# EAGLE design labwiz-board (EAGLE 6.5.0)

## Sheet 1 of 2
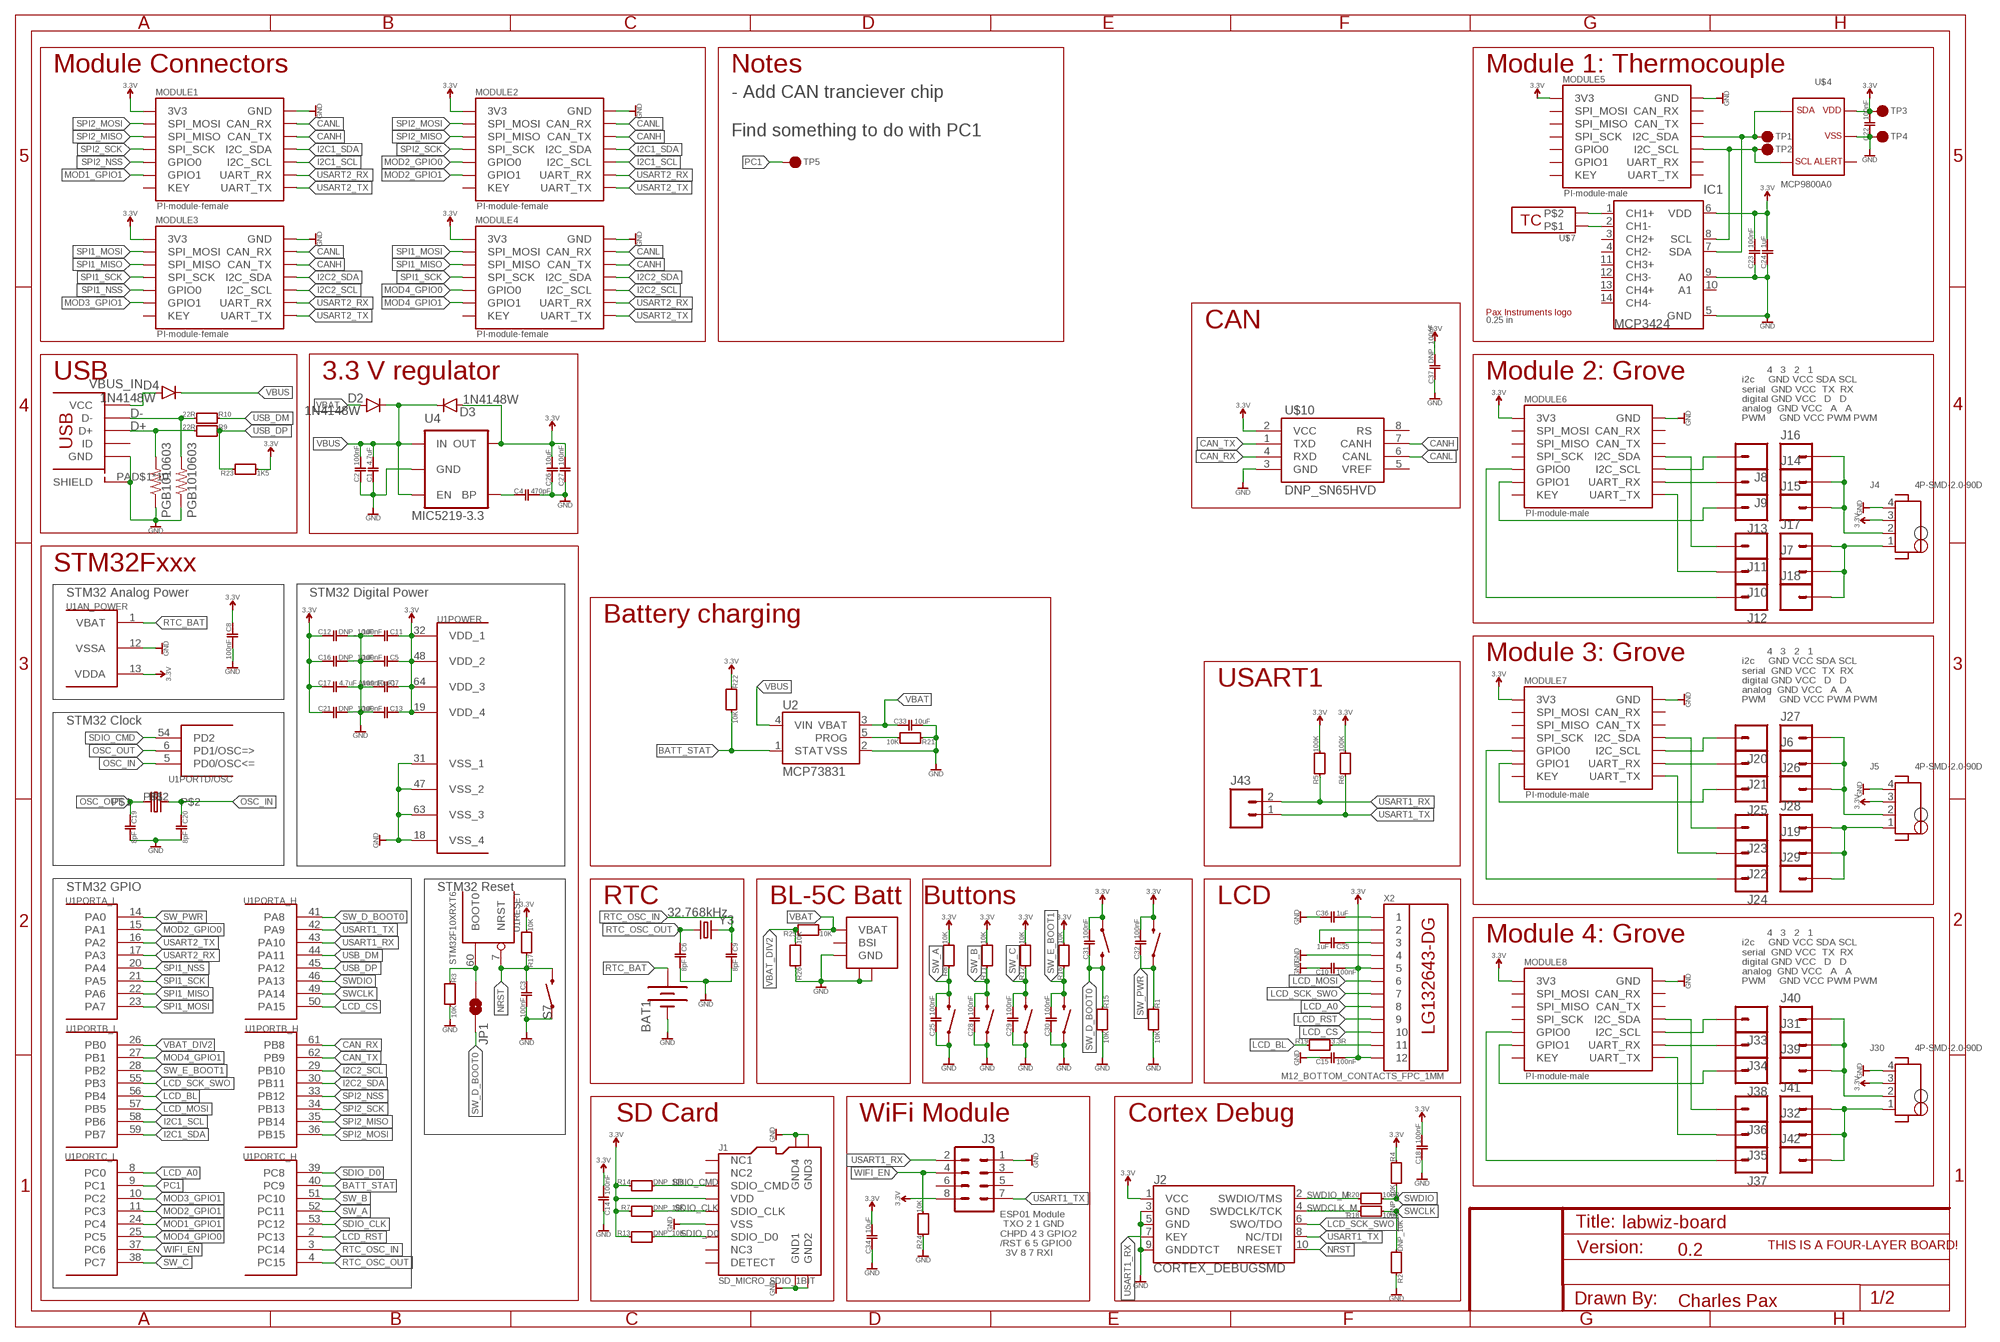
[diagram p0: schematic, sheet 1]

### Parts
BAT1  BATTERY12MM  [BATTCON_12MM]
C1  4.7uF  C0402_4.7UF  [0402]
C2  100nF  C0402_100NF  [0402]
C3  100nF  C0402_100NF  [0402]
C4  470pF  C0402_470PF  [0402]
C5  100nF  C0402_100NF  [0402]
C6  8pF  C0402_8PF  [0402]
C7  100nF  C0402_100NF  [0402]
C8  100nF  C0402_100NF  [0402]
C9  8pF  C0402_8PF  [0402]
C10  100nF  C0402_100NF  [0402]
C11  100nF  C0402_100NF  [0402]
C12  DNP_10uF  C0402_10UF  [0402]
C13  100nF  C0402_100NF  [0402]
C14  100nF  C0402_100NF  [0402]
C15  100nF  C0402_100NF  [0402]
C16  DNP_10uF  C0402_10UF  [0402]
C17  4.7uF (was 10uF)  C0402_10UF  [0402]
C18  100nF  C0402_100NF  [0402]
C19  8pF  C0402_8PF  [0402]
C20  8pF  C0402_8PF  [0402]
C21  DNP_10uF  C0402_10UF  [0402]
C22  100nF  C0402_100NF  [0402]
C23  100nF  C0402_100NF  [0402]
C24  1uF  C0402_1UF  [0402]
C25  100nF  C0402_100NF  [0402]
C26  10uF  C0402_10UF  [0402]
C27  100nF  C0402_100NF  [0402]
C28  100nF  C0402_100NF  [0402]
C29  100nF  C0402_100NF  [0402]
C30  100nF  C0402_100NF  [0402]
C31  100nF  C0402_100NF  [0402]
C32  100nF  C0402_100NF  [0402]
C33  10uF  C0402_10UF  [0402]
C34  10uF  C0402_10UF  [0402]
C35  1uF  C0402_1UF  [0402]
C36  1uF  C0402_1UF  [0402]
C37  DNP_100nF  C0402_100NF  [0402]
D2  1N4148W  DIODESOD123  [SOD-123]
D3  1N4148W  DIODESOD123  [SOD-123]
D4  1N4148W  DIODESOD123  [SOD-123]
IC1  MCP3424  [SO14]
J1  SD_MICRO_SDIO_1BIT  [SD_MICRO_1]
J2  CORTEX_DEBUGSMD  [SAMTECH_FTSH-105-01]
J3  M04X2  [2X4]
J4  4P-SMD-2.0-90D  GROVE-CONNECTOR-SMD-90D(4+2P-2.0)  [HW4-SMD-2.0-90D]
J5  4P-SMD-2.0-90D  GROVE-CONNECTOR-SMD-90D(4+2P-2.0)  [HW4-SMD-2.0-90D]
J6  M01SMD-4.5X1.5  [PAD-1.5X4.5]
J7  M01SMD-4.5X1.5  [PAD-1.5X4.5]
J8  M01SMD-4.5X1.5  [PAD-1.5X4.5]
J9  M01SMD-4.5X1.5  [PAD-1.5X4.5]
J10  M01SMD-4.5X1.5  [PAD-1.5X4.5]
J11  M01SMD-4.5X1.5  [PAD-1.5X4.5]
J12  M01SMD-4.5X1.5  [PAD-1.5X4.5]
J13  M01SMD-4.5X1.5  [PAD-1.5X4.5]
J14  M01SMD-4.5X1.5  [PAD-1.5X4.5]
J15  M01SMD-4.5X1.5  [PAD-1.5X4.5]
J16  M01SMD-4.5X1.5  [PAD-1.5X4.5]
J17  M01SMD-4.5X1.5  [PAD-1.5X4.5]
J18  M01SMD-4.5X1.5  [PAD-1.5X4.5]
J19  M01SMD-4.5X1.5  [PAD-1.5X4.5]
J20  M01SMD-4.5X1.5  [PAD-1.5X4.5]
J21  M01SMD-4.5X1.5  [PAD-1.5X4.5]
J22  M01SMD-4.5X1.5  [PAD-1.5X4.5]
J23  M01SMD-4.5X1.5  [PAD-1.5X4.5]
J24  M01SMD-4.5X1.5  [PAD-1.5X4.5]
J25  M01SMD-4.5X1.5  [PAD-1.5X4.5]
J26  M01SMD-4.5X1.5  [PAD-1.5X4.5]
J27  M01SMD-4.5X1.5  [PAD-1.5X4.5]
J28  M01SMD-4.5X1.5  [PAD-1.5X4.5]
J29  M01SMD-4.5X1.5  [PAD-1.5X4.5]
J30  4P-SMD-2.0-90D  GROVE-CONNECTOR-SMD-90D(4+2P-2.0)  [HW4-SMD-2.0-90D]
J31  M01SMD-4.5X1.5  [PAD-1.5X4.5]
J32  M01SMD-4.5X1.5  [PAD-1.5X4.5]
J33  M01SMD-4.5X1.5  [PAD-1.5X4.5]
J34  M01SMD-4.5X1.5  [PAD-1.5X4.5]
J35  M01SMD-4.5X1.5  [PAD-1.5X4.5]
J36  M01SMD-4.5X1.5  [PAD-1.5X4.5]
J37  M01SMD-4.5X1.5  [PAD-1.5X4.5]
J38  M01SMD-4.5X1.5  [PAD-1.5X4.5]
J39  M01SMD-4.5X1.5  [PAD-1.5X4.5]
J40  M01SMD-4.5X1.5  [PAD-1.5X4.5]
J41  M01SMD-4.5X1.5  [PAD-1.5X4.5]
J42  M01SMD-4.5X1.5  [PAD-1.5X4.5]
J43  M02PTH  [1X02]
JP1  JUMPER-PAD-2-NOYES_SILK  [PAD-JUMPER-2-NO_YES_SILK]
MODULE1  PI-module-female  PAX_MODULE_EDGE_FEMALE_HOST  [M07X2_2MM_EDGE]
MODULE2  PI-module-female  PAX_MODULE_EDGE_FEMALE_HOST  [M07X2_2MM_EDGE]
MODULE3  PI-module-female  PAX_MODULE_EDGE_FEMALE_HOST  [M07X2_2MM_EDGE]
MODULE4  PI-module-female  PAX_MODULE_EDGE_FEMALE_HOST  [M07X2_2MM_EDGE]
MODULE5  PI-module-male  PAX_MODULE_EDGE_MALE_MODULE  [M07X2_2MM_EDGE]
MODULE6  PI-module-male  PAX_MODULE_EDGE_MALE_MODULE  [M07X2_2MM_EDGE]
MODULE7  PI-module-male  PAX_MODULE_EDGE_MALE_MODULE  [M07X2_2MM_EDGE]
MODULE8  PI-module-male  PAX_MODULE_EDGE_MALE_MODULE  [M07X2_2MM_EDGE]
R1  10K  R0402_10K  [0402]
R2  DNP_10K  R0402_10K  [0402]
R3  10K  R0402_10K  [0402]
R4  DNP_10K  R0402_10K  [0402]
R5  100K  R0402_10K  [0402]
R6  100K  R0402_10K  [0402]
R7  DNP_10K  R0402_10K  [0402]
R8  10K  R0402_10K  [0402]
R9  22R  R0402_22R  [R0402]
R10  22R  R0402_22R  [R0402]
R11  10K  R0402_10K  [0402]
R12  10K  R0402_10K  [0402]
R13  DNP_10K  R0402_10K  [0402]
R14  DNP_10K  R0402_10K  [0402]
R15  10K  R0402_10K  [0402]
R16  10K  R0402_10K  [0402]
R17  10K  R0402_10K  [0402]
R18  100R  R0402_100R  [0402]
R19  3.3R  R0402_3.3R  [0402]
R20  100R  R0402_100R  [0402]
R21  10K  R0402_10K  [0402]
R22  10K  R0402_10K  [0402]
R23  1K5  R0402_22R  [R0402]
R24  10K  R0402_10K  [0402]
R25  10K  R0402_10K  [0402]
R26  10K  R0402_10K  [0402]
S1  SWITCH-MOMENTARY-2SMD  [TACTILE_SWITCH_SMD]
S2  SWITCH-MOMENTARY-2SMD  [TACTILE_SWITCH_SMD]
S3  SWITCH-MOMENTARY-2SMD  [TACTILE_SWITCH_SMD]
S4  SWITCH-MOMENTARY-2SMD  [TACTILE_SWITCH_SMD]
S5  SWITCH-MOMENTARY-2SMD  [TACTILE_SWITCH_SMD]
S6  SWITCH-MOMENTARY-2SMD  [TACTILE_SWITCH_SMD]
S7  SWITCH-MOMENTARY-2SMD-3  [TACTILE_SWITCH_SMD-3]
TP1  M01_TH  [M01_TH]
TP2  M01_TH  [M01_TH]
TP3  M01_TH  [M01_TH]
TP4  M01_TH  [M01_TH]
TP5  M01_PAD_1MM  [PAD_1MM]
U1  STM32F10XRXT6  [TQFP64]
U2  MCP73831  [SOT23-5]
U4  MIC5219-3.3V  V_REG_LDOSMD  [SOT23-5]
U$1  USB_MICROSMT+THRUHULE  [USB_MICRO_THRUHOLE]
U$2  FOUR_LAYER_WARNING  [FOUR_LAYER_WARNING]
U$3  BL-5C-CONNECTOR  [BL-5C-CONNECTOR]
U$4  MCP9800A0  [SOT23-5L]
U$5  LG132643-DG  [LG132643-DG]
U$7  THERMOCOUPLE_MINI_INSIDE  [THERMOCOUPLE_CLIP_INSIDE]
U$9  NX3225GD  [NX3225GD]
U$10  DNP_SN65HVD  SN65HVD  [SO08]
U$13  0.25 in  PAX-LOGO_0.25IN  [PAX-LOGO-0.25IN]
X2  M12_BOTTOM_CONTACTS_FPC_1MM  [FPC_12P_1MM]
Y3  32.768kHz  CRYSTAL3.2X1.5MM  [CRYSTAL-SMD-3.2X1.5MM]
Z1  PGB1010603  SPARKFUN-RESISTORS_RESISTOR0603-RES  [SPARKFUN-RESISTORS_0603-RES]
Z2  PGB1010603  SPARKFUN-RESISTORS_RESISTOR0603-RES  [SPARKFUN-RESISTORS_0603-RES]

### Nets
3.3V: C5.1 C7.1 C8.1 C10.2 C11.1 C12.1 C13.1 C14.2 C15.2 C16.1 C17.1 C18.2 C21.1 C26.2 C27.2 C31.2 C32.2 C34.2 C37.2 D3.A J1.4(VDD) J2.1(VCC) J3.8 MODULE1.P$1(3V3) MODULE2.P$1(3V3) MODULE3.P$1(3V3) MODULE4.P$1(3V3) R4.2 R5.1 R6.1 R7.2 R8.1 R11.1 R12.1 R13.2 R14.2 R16.1 R17.1 R22.2 R23.1 S4.1 S6.3 U1.13(AN_POWER:VDDA) U1.19(POWER:VDD_4) U1.32(POWER:VDD_1) U1.48(POWER:VDD_2) U1.64(POWER:VDD_3) U4.5(OUT) U$10.2(VCC) X2.5 X2.12
3.3V_1: C22.2 C23.2 C24.2 IC1.6(VDD) MODULE5.P$13(3V3) TP3.P$1 U$4.1 ; supply symbol labelled 3.3V
3.3V_2: J4.3 MODULE6.P$13(3V3) ; supply symbol labelled 3.3V
3.3V_3: J5.3 MODULE7.P$13(3V3) ; supply symbol labelled 3.3V
3.3V_4: J30.3 MODULE8.P$13(3V3) ; supply symbol labelled 3.3V
BATT_STAT: R22.1 U1.40(PORTC_H:PC9) U2.1(STAT)
BOOT0: JP1.2 R3.2 U1.60(RESET:BOOT0)
CAN_RX: U1.61(PORTB_H:PB8) U$10.4(RXD)
CAN_TX: U1.62(PORTB_H:PB9) U$10.1(TXD)
CANH: MODULE1.P$6(CAN_TX) MODULE2.P$6(CAN_TX) MODULE3.P$6(CAN_TX) MODULE4.P$6(CAN_TX) U$10.7(CANH)
CANL: MODULE1.P$4(CAN_RX) MODULE2.P$4(CAN_RX) MODULE3.P$4(CAN_RX) MODULE4.P$4(CAN_RX) U$10.6(CANL)
D+: R9.1 U$1.PIN$3(D+) Z1.2
D-: R10.1 U$1.PIN$2(D-) Z2.2
GND [GND]: BAT1.GND(-) C1.1 C2.1 C3.2 C4.2 C5.2 C6.2 C7.2 C8.2 C9.2 C10.1 C11.2 C12.2 C13.2 C14.1 C15.1 C16.2 C17.2 C18.1 C19.2 C20.2 C21.2 C25.1 C26.1 C27.1 C28.1 C29.1 C30.1 C33.2 C34.1 C36.1 C37.1 J1.6(VSS) J1.G1(GND1) J1.G2(GND2) J1.G3(GND3) J1.G4(GND4) J2.3(GND) J2.5(GND) J2.9(GNDDTCT) J3.1 MODULE1.P$2(GND) MODULE2.P$2(GND) MODULE3.P$2(GND) MODULE4.P$2(GND) R1.1 R2.2 R3.1 R15.1 R21.2 R24.2 R26.2 S1.1 S2.1 S3.1 S5.1 S7.1 U1.12(AN_POWER:VSSA) U1.18(POWER:VSS_4) U1.31(POWER:VSS_1) U1.47(POWER:VSS_2) U1.63(POWER:VSS_3) U2.2(VSS) U4.2(GND) U$1.PAD$1(SHIELD) U$1.PAD$2(SHIELD) U$1.PAD$3(SHIELD) U$1.PAD$4(SHIELD) U$1.PAD$5(SHIELD) U$1.PAD$6(SHIELD) U$1.PAD$7(SHIELD) U$1.PAD$8(SHIELD) U$1.PAD$9(SHIELD) U$1.PAD$10(SHIELD) U$1.PIN$5(GND) U$3.P$3(GND) U$3.P$4 U$3.P$5 U$10.3(GND) X2.4 Z1.1 Z2.1
GND_1 [GND]: C22.1 C23.1 C24.1 IC1.5(GND) IC1.9(A0) MODULE5.P$14(GND) TP4.P$1 U$4.2 ; supply symbol labelled GND
GND_2 [GND]: J4.4 MODULE6.P$14(GND) ; supply symbol labelled GND
GND_3 [GND]: J5.4 MODULE7.P$14(GND) ; supply symbol labelled GND
GND_4 [GND]: J30.4 MODULE8.P$14(GND) ; supply symbol labelled GND
I2C1_SCL: MODULE1.P$10(I2C_SCL) MODULE2.P$10(I2C_SCL) U1.58(PORTB_L:PB6)
I2C1_SDA: MODULE1.P$8(I2C_SDA) MODULE2.P$8(I2C_SDA) U1.59(PORTB_L:PB7)
I2C2_SCL: MODULE3.P$10(I2C_SCL) MODULE4.P$10(I2C_SCL) U1.29(PORTB_H:PB10)
I2C2_SDA [3.3V power]: MODULE3.P$8(I2C_SDA) MODULE4.P$8(I2C_SDA) U1.30(PORTB_H:PB11)
LCD_A0: U1.8(PORTC_L:PC0) X2.8
LCD_BL: R19.2 U1.56(PORTB_L:PB4)
LCD_CS: U1.50(PORTA_H:PA15) X2.10
LCD_MOSI: U1.57(PORTB_L:PB5) X2.6
LCD_RST: U1.2(PORTC_H:PC13) X2.9
LCD_SCK_SWO: J2.6(SWO/TDO) U1.55(PORTB_L:PB3) X2.7
MOD1_GPIO1: MODULE1.P$11(GPIO1) U1.24(PORTC_L:PC4)
MOD2_GPIO0: MODULE2.P$9(GPIO0) U1.15(PORTA_L:PA1)
MOD2_GPIO1: MODULE2.P$11(GPIO1) U1.11(PORTC_L:PC3)
MOD3_GPIO1: MODULE3.P$11(GPIO1) U1.10(PORTC_L:PC2)
MOD4_GPIO0: MODULE4.P$9(GPIO0) U1.25(PORTC_L:PC5)
MOD4_GPIO1: MODULE4.P$11(GPIO1) U1.27(PORTB_L:PB1)
N$1: C4.1 U4.4(BP)
N$4: R19.1 X2.11
N$5: J4.2 J14.P$1 J15.P$1 J16.P$1
N$13: J5.2 J6.P$1 J26.P$1 J27.P$1
N$25: IC1.2(CH1-) U$7.P$1
N$26: IC1.1(CH1+) U$7.P$2
N$37: C35.1 X2.3
N$38: C35.2 X2.2
N$39: C36.2 X2.1
N$42: J4.1 J7.P$1 J17.P$1 J18.P$1
N$43: J5.1 J19.P$1 J28.P$1 J29.P$1
N$45: J20.P$1 MODULE7.P$6(I2C_SCL)
N$47: J21.P$1 MODULE7.P$4(UART_RX)
N$51: J8.P$1 MODULE6.P$6(I2C_SCL)
N$52: J9.P$1 MODULE6.P$4(UART_RX)
N$53: J10.P$1 MODULE6.P$2(UART_TX)
N$54: J11.P$1 MODULE6.P$8(I2C_SDA)
N$55: J13.P$1 MODULE6.P$3(GPIO1)
N$56: J12.P$1 MODULE6.P$5(GPIO0)
N$57: J22.P$1 MODULE7.P$2(UART_TX)
N$58: J23.P$1 MODULE7.P$8(I2C_SDA)
N$59: J25.P$1 MODULE7.P$3(GPIO1)
N$60: J24.P$1 MODULE7.P$5(GPIO0)
N$61: J30.2 J31.P$1 J39.P$1 J40.P$1
N$62: J30.1 J32.P$1 J41.P$1 J42.P$1
N$63: J33.P$1 MODULE8.P$6(I2C_SCL)
N$64: J34.P$1 MODULE8.P$4(UART_RX)
N$65: J35.P$1 MODULE8.P$2(UART_TX)
N$66: J36.P$1 MODULE8.P$8(I2C_SDA)
N$67: J38.P$1 MODULE8.P$3(GPIO1)
N$68: J37.P$1 MODULE8.P$5(GPIO0)
N$70: R21.1 U2.5(PROG)
NRST: C3.1 J2.10(NRESET) R17.2 S7.4 U1.7(RESET:NRST)
OSC_IN: C20.1 U1.5(PORTD/OSC:PD0/OSC<=) U$9.P$2
OSC_OUT: C19.1 U1.6(PORTD/OSC:PD1/OSC=>) U$9.P$1
PC1: TP5.P$1 U1.9(PORTC_L:PC1)
RTC_BAT [RTC battery]: BAT1.PWR@1(+) U1.1(AN_POWER:VBAT)
RTC_OSC_IN: C9.1 U1.3(PORTC_H:PC14) Y3.P$2
RTC_OSC_OUT: C6.1 U1.4(PORTC_H:PC15) Y3.P$1
SCL_1: IC1.8(SCL) MODULE5.P$6(I2C_SCL) TP2.P$1 U$4.4
SDA_1: IC1.7(SDA) MODULE5.P$8(I2C_SDA) TP1.P$1 U$4.5
SDIO_CLK: J1.5(SDIO_CLK) R7.1 U1.53(PORTC_H:PC12)
SDIO_CMD: J1.3(SDIO_CMD) R14.1 U1.54(PORTD/OSC:PD2)
SDIO_D0: J1.7(SDIO_D0) R13.1 U1.39(PORTC_H:PC8)
SPI1_MISO: MODULE3.P$5(SPI_MISO) MODULE4.P$5(SPI_MISO) U1.22(PORTA_L:PA6)
SPI1_MOSI: MODULE3.P$3(SPI_MOSI) MODULE4.P$3(SPI_MOSI) U1.23(PORTA_L:PA7)
SPI1_NSS: MODULE3.P$9(GPIO0) U1.20(PORTA_L:PA4)
SPI1_SCK: MODULE3.P$7(SPI_SCK) MODULE4.P$7(SPI_SCK) U1.21(PORTA_L:PA5)
SPI2_MISO: MODULE1.P$5(SPI_MISO) MODULE2.P$5(SPI_MISO) U1.35(PORTB_H:PB14)
SPI2_MOSI: MODULE1.P$3(SPI_MOSI) MODULE2.P$3(SPI_MOSI) U1.36(PORTB_H:PB15)
SPI2_NSS: MODULE1.P$9(GPIO0) U1.33(PORTB_H:PB12)
SPI2_SCK: MODULE1.P$7(SPI_SCK) MODULE2.P$7(SPI_SCK) U1.34(PORTB_H:PB13)
SW_A: C25.2 R8.2 S3.3 U1.52(PORTC_H:PC11)
SW_B: C28.2 R11.2 S2.3 U1.51(PORTC_H:PC10)
SW_C: C29.2 R12.2 S1.3 U1.38(PORTC_L:PC7)
SW_D_BOOT0: C31.1 JP1.1 R15.2 S4.3 U1.41(PORTA_H:PA8)
SW_E_BOOT1: C30.2 R16.2 S5.3 U1.28(PORTB_L:PB2)
SW_PWR: C32.1 R1.2 S6.1 U1.14(PORTA_L:PA0)
SWCLK: R2.1 R18.1 U1.49(PORTA_H:PA14)
SWDCLK_M: J2.4(SWDCLK/TCK) R18.2
SWDIO: R4.1 R20.1 U1.46(PORTA_H:PA13)
SWDIO_M: J2.2(SWDIO/TMS) R20.2
USART1_RX: J2.7(KEY) J3.2 J43.2 R5.2 U1.43(PORTA_H:PA10)
USART1_TX: J2.8(NC/TDI) J3.7 J43.1 R6.2 U1.42(PORTA_H:PA9)
USART2_RX: MODULE1.P$12(UART_RX) MODULE2.P$12(UART_RX) MODULE3.P$12(UART_RX) MODULE4.P$12(UART_RX) U1.17(PORTA_L:PA3)
USART2_TX: MODULE1.P$14(UART_TX) MODULE2.P$14(UART_TX) MODULE3.P$14(UART_TX) MODULE4.P$14(UART_TX) U1.16(PORTA_L:PA2)
USB_DM: R10.2 U1.44(PORTA_H:PA11)
USB_DP: R9.2 R23.2 U1.45(PORTA_H:PA12)
VBAT: C33.1 D2.A R25.1 U2.3(VBAT) U$3.P$1(VBAT)
VBAT_DIV2: R25.2 R26.1 U1.26(PORTB_L:PB0)
VBUS [3.3V power]: C1.2 C2.2 D2.C D3.C D4.C U2.4(VIN) U4.1(IN) U4.3(EN)
VBUS_IN [3.3V power]: D4.A U$1.PIN$1(VCC)
WIFI_EN: J3.4 R24.1 U1.37(PORTC_L:PC6)
Unconnected: IC1.3(CH2+) IC1.4(CH2-) IC1.10(A1) IC1.11(CH3+) IC1.12(CH3-) IC1.13(CH4+) IC1.14(CH4-) J1.1(NC1) J1.2(NC2) J1.8(NC3) J1.9(DETECT) J3.3 J3.5 J3.6 J4.SS1 J4.SS2 J5.SS1 J5.SS2 J30.SS1 J30.SS2 MODULE1.P$13(KEY) MODULE2.P$13(KEY) MODULE3.P$13(KEY) MODULE4.P$13(KEY) MODULE5.P$1(KEY) MODULE5.P$2(UART_TX) MODULE5.P$3(GPIO1) MODULE5.P$4(UART_RX) MODULE5.P$5(GPIO0) MODULE5.P$7(SPI_SCK) MODULE5.P$9(SPI_MISO) MODULE5.P$10(CAN_TX) MODULE5.P$11(SPI_MOSI) MODULE5.P$12(CAN_RX) MODULE6.P$1(KEY) MODULE6.P$7(SPI_SCK) MODULE6.P$9(SPI_MISO) MODULE6.P$10(CAN_TX) MODULE6.P$11(SPI_MOSI) MODULE6.P$12(CAN_RX) MODULE7.P$1(KEY) MODULE7.P$7(SPI_SCK) MODULE7.P$9(SPI_MISO) MODULE7.P$10(CAN_TX) MODULE7.P$11(SPI_MOSI) MODULE7.P$12(CAN_RX) MODULE8.P$1(KEY) MODULE8.P$7(SPI_SCK) MODULE8.P$9(SPI_MISO) MODULE8.P$10(CAN_TX) MODULE8.P$11(SPI_MOSI) MODULE8.P$12(CAN_RX) U$1.PIN$4(ID) U$3.P$2(BSI) U$4.3 U$10.5(VREF) U$10.8(RS)

### Notes on the sheet
- Module Connectors | Notes | Module 1: Thermocouple
- - Add CAN tranciever chip
- Find something to do with PC1
- CAN
- 4   3   2   1
  i2c     GND VCC SDA SCL
  serial  GND VCC  TX  RX
  digital GND VCC   D   D
  analog  GND VCC   A   A
  PWM     GND VCC PWM PWM
- USB | 3.3 V regulator | Module 2: Grove
- MIC5219-3.3
- STM32Fxxx
- STM32 Analog Power | STM32 Digital Power
- Battery charging
- 4   3   2   1
  i2c     GND VCC SDA SCL
  serial  GND VCC  TX  RX
  digital GND VCC   D   D
  analog  GND VCC   A   A
  PWM     GND VCC PWM PWM
- Module 3: Grove
- USART1
- STM32 Clock
- STM32 GPIO | STM32 Reset
- RTC | BL-5C Batt | Buttons | LCD
- 4   3   2   1
  i2c     GND VCC SDA SCL
  serial  GND VCC  TX  RX
  digital GND VCC   D   D
  analog  GND VCC   A   A
  PWM     GND VCC PWM PWM
- Module 4: Grove
- SD Card | WiFi Module | Cortex Debug
- ESP01 Module
   TXO 2 1 GND
  CHPD 4 3 GPIO2
  /RST 6 5 GPIO0
    3V 8 7 RXI
- 0.2
- Charles Pax

## Sheet 2 of 2

## Library data of the parts
BAT1 = PaxInstruments-Electromechanical:BATTERY: Battery Holders Various common sizes : AA, AAA, 20mm coin cell and 12mm coin cell. 20MM_4LEGS, BATT-10373; MF: Keystone Electronics; MPN: 3000TR
C1-C11 C13-C15 C18-C20 C22-C36 = PaxInstruments-RCL:C0402
C12 C16 C17 C21 = PaxInstruments-RCL:C0402; VALUE: 10uF
C37 = PaxInstruments-RCL:C0402; VALUE: 100nF
D2-D4 = SparkFun-DiscreteSemi:DIODE: Diode These are standard reverse protection diodes and small signal diodes. SMA package can handle up to about 1A. SOD-323 can handle about 200mA. What the SOD-323 package when ordering, there are some mfgs out there that are 5-pin packages.
IC1 = PaxInstruments-DigitalIC:MCP3424: 18-Bit, 4-Channel Sampling ANALOG-TO-DIGITAL CONVERTER with I2C? Interface Source: www.ti.com .. ADS7828.pdf; MF: Microchip Technology; MPN: MCP3424-E/SL
J1 = PaxInstruments-Connectors:SD_MICRO_SDIO_1BIT
J2 = SparkFun-Connectors:CORTEX_DEBUG: Cortex Debug Connector Datasheet <http://infocenter.arm.com/help/topic/com.arm.doc.faqs/attached/13634/cortex_debug_connectors.pdf>
J3 = SparkFun-Connectors:M04X2: .1" header, two rows of four.
J4 J5 J30 = PaxInstruments-Connectors:GROVE-CONNECTOR-SMD-90D(4+2P-2.0): 320110032
J6-J29 J31-J42 = SparkFun-Connectors:M01: Header 1 Standard 1-pin 0.1" header. Use with straight break away headers (SKU : PRT-00116), right angle break away headers (PRT-00553), swiss pins (PRT-00743), machine pins (PRT-00117), and female headers (PRT-00115). SMTSO-256-ET is a "flush mount" nut for a 4-40 screw. The older package used to be too tight, and did not allow it to sit properly thru the drill hit. The latest (0.165DIA) fits nice and snug.
J43 = SparkFun-Connectors:M02: Standard 2-pin 0.1" header. Use with - straight break away headers ( PRT-00116) - right angle break away headers (PRT-00553) - swiss pins (PRT-00743) - machine pins (PRT-00117) - female headers (PRT-00115) Molex polarized connector foot print use with: PRT-08233 with associated crimp pins and housings. 2.54_SCREWTERM for use with PRT-10571. 3.5mm Screw Terminal footprints for PRT-08084 5mm Screw Terminal footprints for use with PRT-08432
JP1 = SparkFun-Passives:JUMPER-PAD-2-NO
MODULE1-MODULE8 = PaxInstruments-Connectors:PAX_MODULE; MF: Pax Instruments; MPN: PIxxxx
R1-R8 R11-R17 R21 R22 R24-R26 = PaxInstruments-RCL:R0402; VALUE: _10K
R9 R10 = PaxInstruments-Resistors:R0402
R18-R20 = PaxInstruments-RCL:R0402
R23 = PaxInstruments-Resistors:R0402; VALUE: 22R
S1-S6 = SparkFun-Electromechanical:SWITCH-MOMENTARY-2: Various NO switches- pushbuttons, reed, etc; MF: C&K Components; MPN: RS-187R05A2-DS MT RT
S7 = PaxInstruments-Electromechanical:SWITCH-MOMENTARY-2: Various NO switches- pushbuttons, reed, etc
TP1-TP5 = PaxInstruments-Connectors:M01
U1 = stm32:STM32F10XRXT6: STM32F101/103 64pin LQFP
U2 = PaxInstruments-PowerIC:MCP73831: Miniature single cell, fully integrated Li-Ion, Li-polymer charge management controller http://ww1.microchip.com/downloads/en/DeviceDoc/21984a.pdf IC-09995; MF: Microchip Technology; MPN: MCP73832T-2DCI/OT
U4 = SparkFun:V_REG_LDO: Voltage Regulator LDO Standard 150mA LDO voltage regulator in SOT-23 layout. Micrel part MIC5205. BP (by-pass) pin is used to lower output noise with 470pF cap.; MF: Micrel; MPN: MIC5219-3.3YM5 TR
U$1 = blinkinlabs:USB_MICRO; MF: FCI; MPN: 10118194-0001LF
U$2 = SparkFun-Aesthetics:FOUR_LAYER_WARNING: Warning text which will appear on both the schematic and the board file, notifying viewers that the design is a four-layer PCB.
U$3 = PaxInstruments-Connectors:BL-5C-CONNECTOR; MPN: BC-4-3P (77H)
U$4 = PaxInstruments-DigitalIC:MCP9800; I2C_ADDRESS: 000; MF: Microchip Technology; MPN: MCP9800A0T-M/OT
U$5 = charlespax:LG132643-DG; MPN: LG132643-DW
U$7 = PaxInstruments-Connectors:THERMOCOUPLE_MINI; MF: Pax Instruments; MPN: PI1024 (2x)
U$9 = PaxInstruments-FreqCtrl:NX3225GD
U$10 = PaxInstruments-DigitalIC:SN65HVD
U$13 = PaxInstruments-Aesthetics:PAX-LOGO
X2 = PaxInstruments-Connectors:M12; MF: Hirose Connector; MPN: FH12-12S-1SH(55)
Y3 = SparkFun-FreqCtrl:CRYSTAL: Various standard crystals. Proven footprints.; PROD_ID: XTAL-13062
Z1 Z2 = PaxInstrument-T400:SPARKFUN-RESISTORS_RESISTOR: Resistor Basic schematic elements and footprints for 0603, 1206, and PTH resistors.; MF: Littelfuse; MPN: PGB1010603NRHF

## Net classes
0 Digital signal: width 0.1 mm, drill 0.2 mm, clearance 0.15 mm
1 3.3V power: width 0.1 mm, drill 0.2 mm, clearance 0.15 mm
2 RTC battery: width 0.1 mm, drill 0.2 mm, clearance 0.15 mm
3 5V power: width 0.1 mm, drill 0.2 mm, clearance 0.15 mm
4 Analog signal: width 0.1 mm, drill 0.2 mm, clearance 0.15 mm
5 GND: width 0.1 mm, drill 0.2 mm, clearance 0.15 mm

## Board
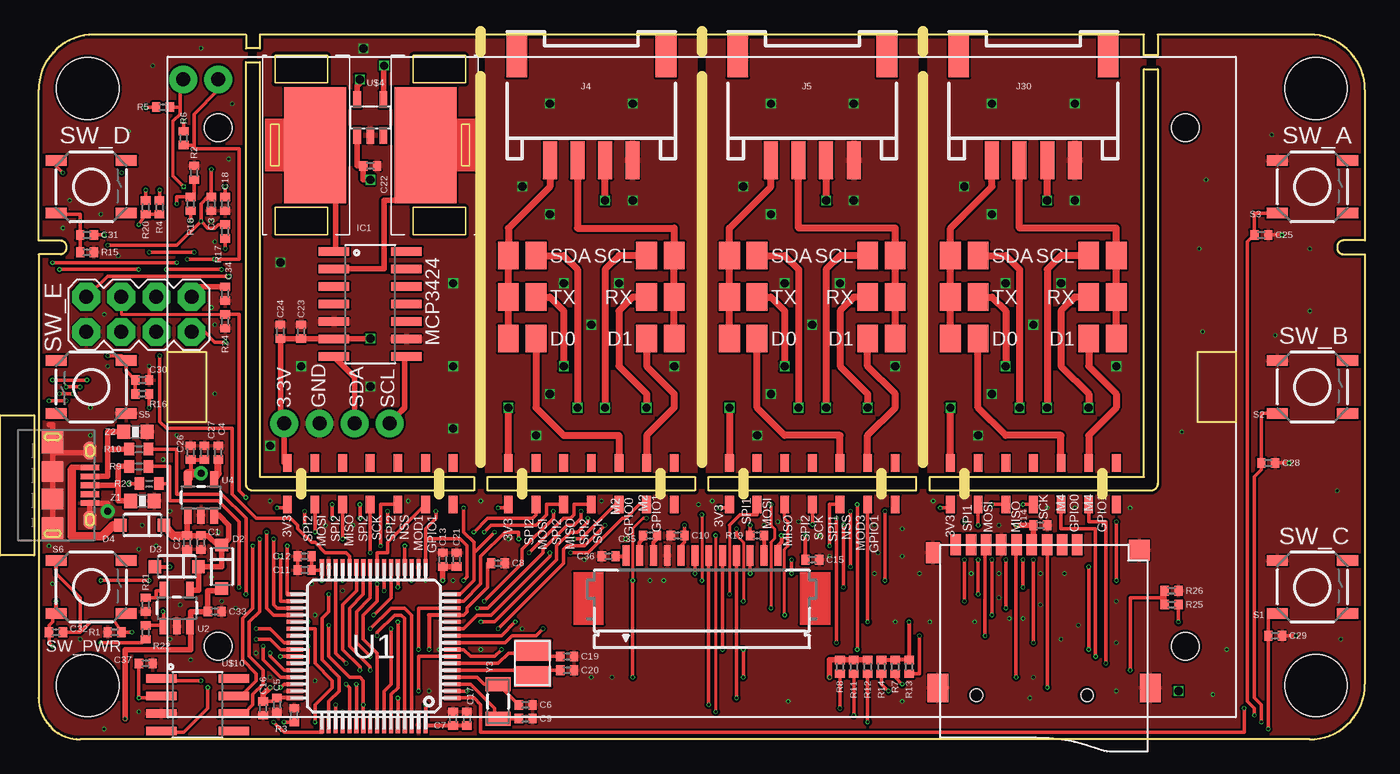
[diagram p1: board, top side]
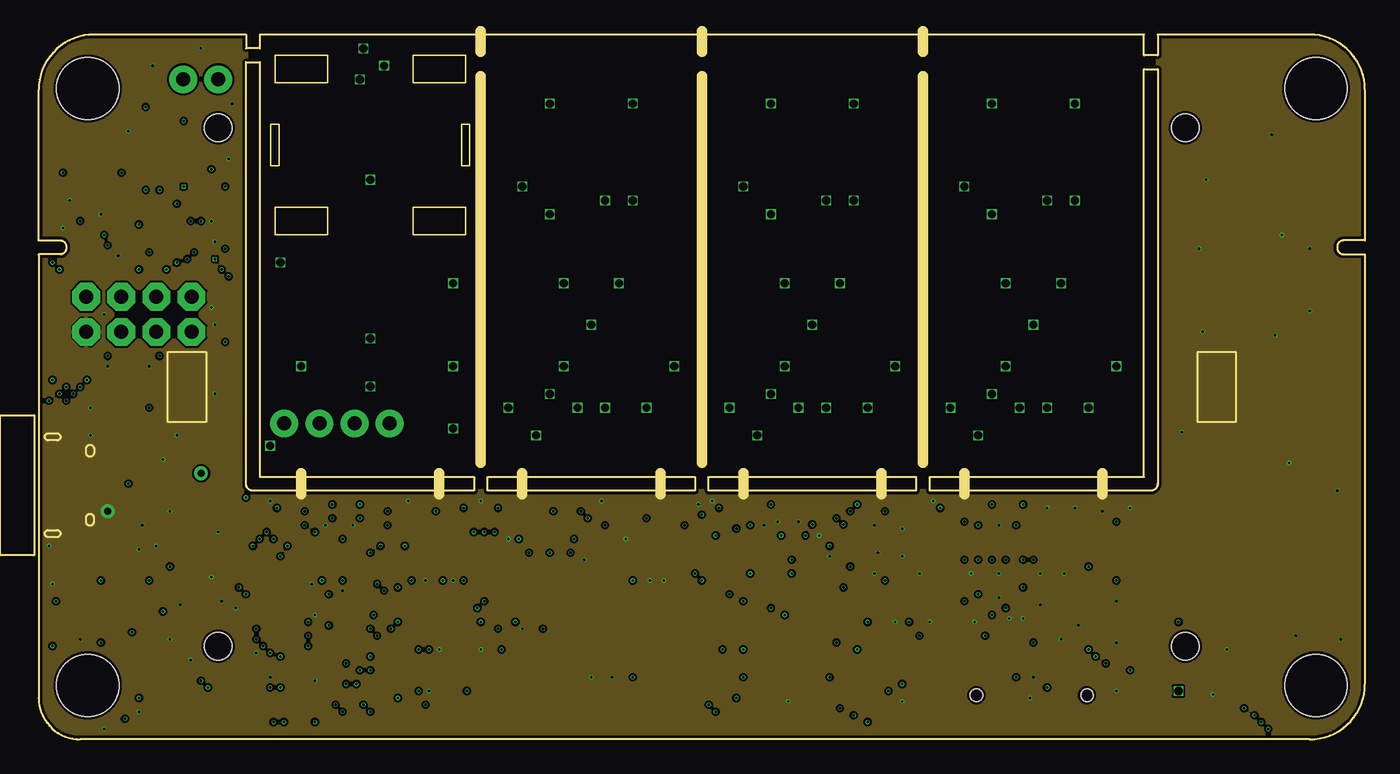
[diagram p2: board, inner layer GND]
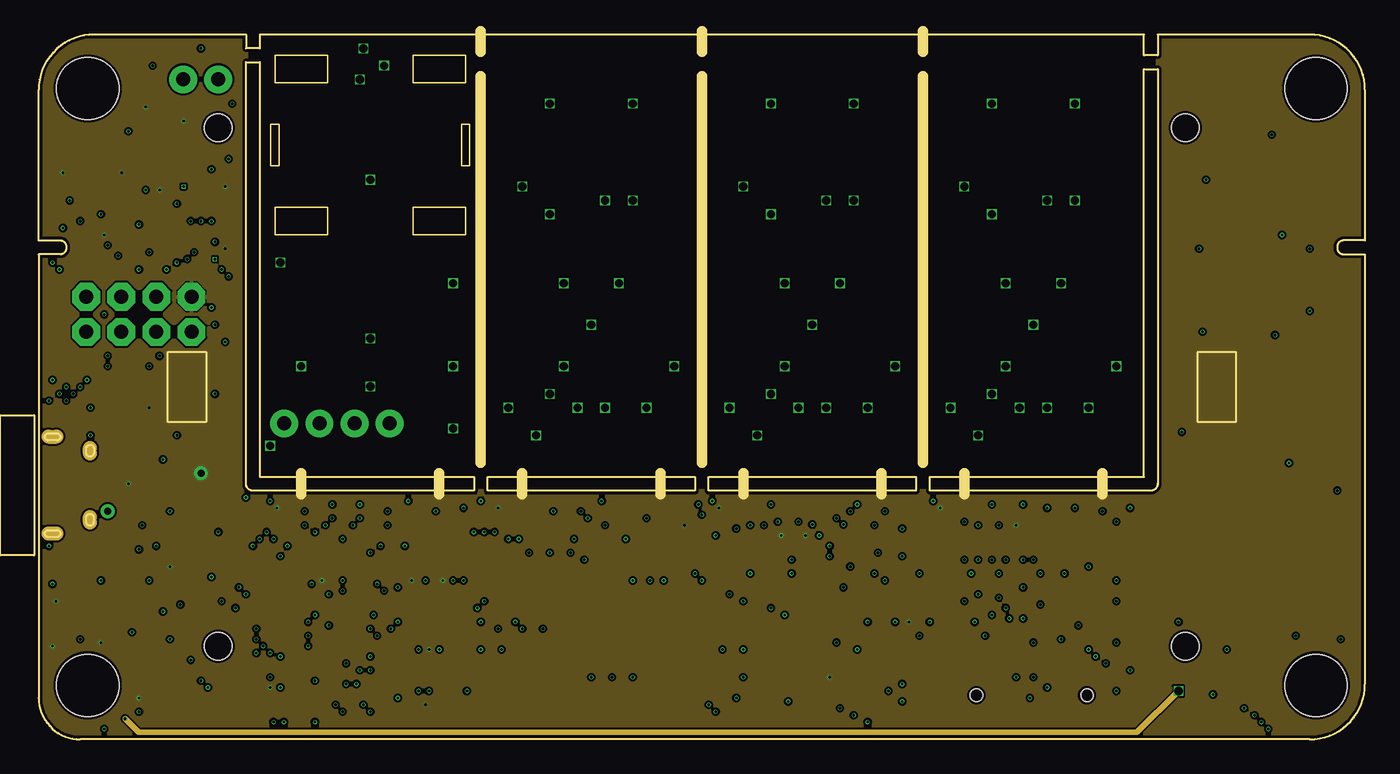
[diagram p3: board, inner layer 3.3V]
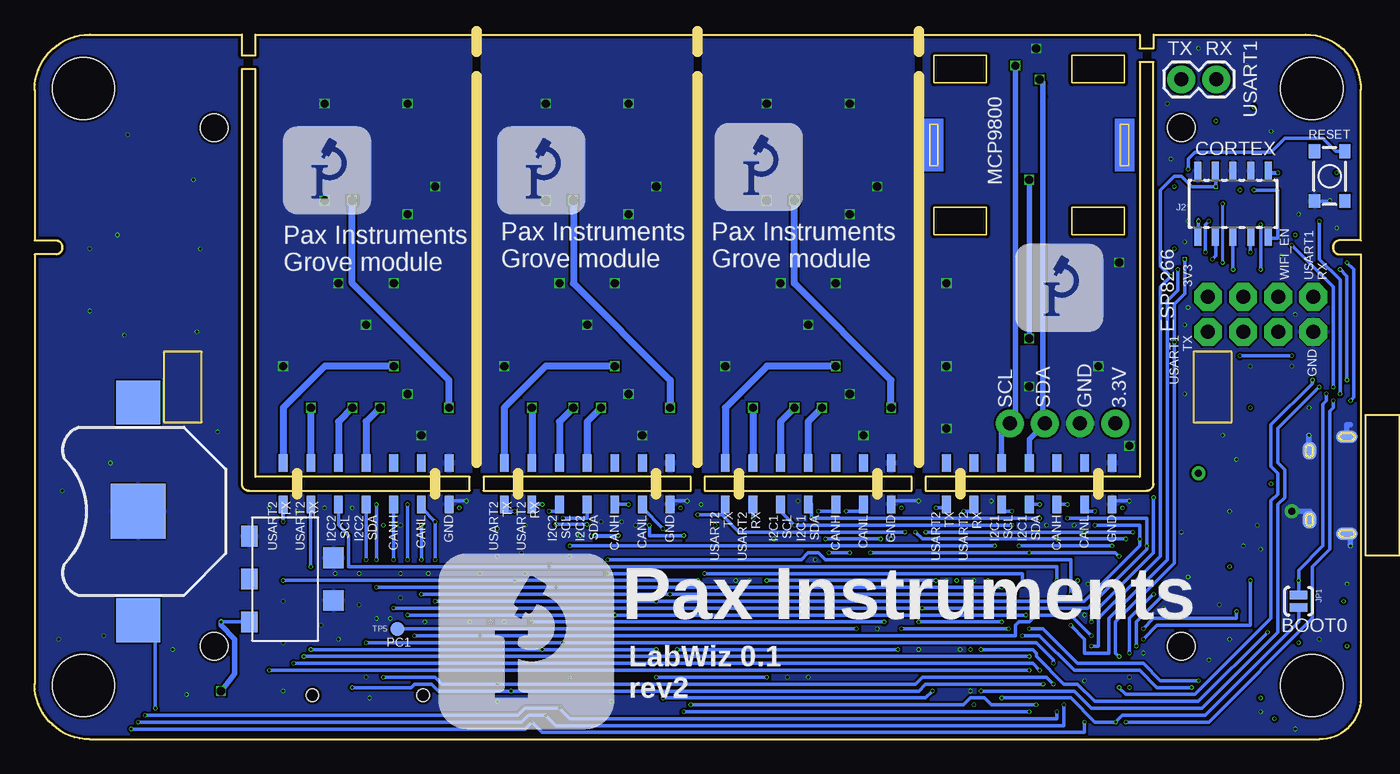
[diagram p4: board, bottom side, seen from below]

Size 96 x 51 mm. Coordinates in mm from the lower left corner, seen from the top.
Outline: 92,0 3,0 arc-90 0,3 0,35.1 1.6,35.1 arc90 2,35.6 arc90 1.6,36.1 0,36.1 0,47 arc-90 4,51 15,51 15,50 16,50 16,51 80,51 80,49.5 81,49.5 81,51 92,51 arc-90 96,47 96,36.1 94.4,36.1 arc90 94,35.6 arc90 94.4,35.1 96,35.1 96,4 arc-90 92,0
Outline: 81,48.5 81,18.5 arc-90 80.5,18 64.5,18 64.5,19 80,19 80,48.5 81,48.5
Outline: 63.5,18 48.5,18 48.5,19 63.5,19 63.5,18
Outline: 47.5,18 32.5,18 32.5,19 47.5,19 47.5,18
Outline: 31.5,18 15.5,18 arc-90 15,18.5 15,49 16,49 16,19 31.5,19 31.5,18
Copper layers (1*2+15*16): Top 0.017mm / dielectric 0.5mm / GND 0.017mm / dielectric 0.075mm / 3.3V 0.017mm / dielectric 0.5mm / Bottom 0.017mm
Design rules "PaxInstrument-T400 *": minimum track width 0.1mm, minimum drill 0.2mm, track to track 0.075mm, track to pad 0.075mm, pad to pad 0.075mm, via to via 0.075mm, smd to smd 0.075mm, copper to edge 0.2mm, drill to drill 0.2mm, minimum pad ring 0.5mm, minimum via ring 0.05mm, stop-mask expansion 0.01mm, vias tented up to drill 0.25mm, thermal gap 0.1mm
Holes 4.5 mm at 92.45,3.91 92.45,47.09 3.55,47.09 3.55,3.91
tKeepout: area 0,0.4 to 7,7.4; area 0,43.6 to 7.1,50.6; area 89,43.6 to 96,50.6; area 89,0.4 to 96,7.4
vRestrict: area 15,1.4 to 81,52.2
Milling: 18 lines

### Footprints (pad centres in the part's own frame; a part is rotated, then mirrored left to right if it is on the bottom)
BATTCON_12MM = smd 3.962 x 3.962: GND 0,0 | smd 3.175 x 3.175: PWR@1 -7.874,0; PWR@2 7.874,0
0402 = smd 0.6 x 0.7: 1 -0.5,0; 2 0.5,0
SOD-123 = smd 0.9 x 0.95: A 1.575,0; C -1.575,0
SO14 = smd 0.61 x 2.21: 1 -3.81,-2.616; 2 -2.54,-2.616; 3 -1.27,-2.616; 4 0,-2.616; 5 1.27,-2.616; 6 2.54,-2.616; 7 3.81,-2.616; 8 3.81,2.616; 9 2.54,2.616; 10 1.27,2.616; 11 0,2.616; 12 -1.27,2.616; 13 -2.54,2.616; 14 -3.81,2.616
SD_MICRO_1 = smd 1.524 x 0.762: 1 -7.493,2.414; 2 -7.493,1.314; 3 -7.493,0.214; 4 -7.493,-0.886; 5 -7.493,-1.986; 6 -7.493,-3.086; 7 -7.493,-4.186; 8 -7.493,-5.286; 9 -7.493,-6.386 | smd 1.524 x 1.016: G1 -6.893,-8.032 | smd 2.032 x 1.524: G2 2.88,-7.686; G3 2.88,7.714 | smd 1.524 x 1.524: G4 -7.101,6.895 | hole 0.889: 3.407,-4.886; 3.407,3.114
SAMTECH_FTSH-105-01 = smd 0.508 x 1.27: 1 -2.54,-2.413; 2 -2.54,2.413; 3 -1.27,-2.413; 4 -1.27,2.413; 5 0,-2.413; 6 0,2.413; 7 1.27,-2.413; 8 1.27,2.413; 9 2.54,-2.413; 10 2.54,2.413
2X4 = drill 1.016 pad 1.88 octagon: 1 -3.81,-1.27; 2 -3.81,1.27; 3 -1.27,-1.27; 4 -1.27,1.27; 5 1.27,-1.27; 6 1.27,1.27; 7 3.81,-1.27; 8 3.81,1.27
HW4-SMD-2.0-90D = smd 1.01 x 2.74: 1 -3,-0.1; 2 -1,-0.1; 3 1,-0.1; 4 3,-0.1 | smd 1.5 x 3: SS1 -5.4,7.4; SS2 5.4,7.4
PAD-1.5X4.5 = smd 1.5 x 2: P$1 0,0
1X02 = drill 1.016 pad 1.88: 1 0,0; 2 2.54,0
PAD-JUMPER-2-NO_YES_SILK = smd 0.635 x 1.27: 1 -0.45,0; 2 0.45,0
M07X2_2MM_EDGE = smd 0.635 x 1.27: P$1 0,0; P$3 2,0; P$5 4,0; P$7 6,0; P$9 8,0; P$11 10,0; P$13 12,0 | smd 0.635 x 1.27 bottom: P$2 0,0; P$4 2,0; P$6 4,0; P$8 6,0; P$10 8,0; P$12 10,0; P$14 12,0
R0402 = smd 0.7 x 0.9: 1 -0.7,0; 2 0.7,0
TACTILE_SWITCH_SMD = smd 1.524 x 0.762: 1 -2.54,1.905; 2 2.54,1.905; 3 -2.54,-1.905; 4 2.54,-1.905
TACTILE_SWITCH_SMD-3 = smd 1 x 0.8: 1 -1.8,1.1; 2 1.8,1.1; 3 -1.8,-1.1; 4 1.8,-1.1
M01_TH = drill 1.016 pad 1.88: P$1 0,0
PAD_1MM = smd 1 x 1: P$1 0,0
TQFP64 = smd 1.2 x 0.3: 1 -5.7,3.75; 2 -5.7,3.25; 3 -5.7,2.75; 4 -5.7,2.25; 5 -5.7,1.75; 6 -5.7,1.25; 7 -5.7,0.75; 8 -5.7,0.25; 9 -5.7,-0.25; 10 -5.7,-0.75; 11 -5.7,-1.25; 12 -5.7,-1.75; 13 -5.7,-2.25; 14 -5.7,-2.75; 15 -5.7,-3.25; 16 -5.7,-3.75; 33 5.7,-3.75; 34 5.7,-3.25; 35 5.7,-2.75; 36 5.7,-2.25; 37 5.7,-1.75; 38 5.7,-1.25; 39 5.7,-0.75; 40 5.7,-0.25; 41 5.7,0.25; 42 5.7,0.75; 43 5.7,1.25; 44 5.7,1.75; 45 5.7,2.25; 46 5.7,2.75; 47 5.7,3.25; 48 5.7,3.75 | smd 0.3 x 1.2: 17 -3.75,-5.7; 18 -3.25,-5.7; 19 -2.75,-5.7; 20 -2.25,-5.7; 21 -1.75,-5.7; 22 -1.25,-5.7; 23 -0.75,-5.7; 24 -0.25,-5.7; 25 0.25,-5.7; 26 0.75,-5.7; 27 1.25,-5.7; 28 1.75,-5.7; 29 2.25,-5.7; 30 2.75,-5.7; 31 3.25,-5.7; 32 3.75,-5.7; 49 3.75,5.7; 50 3.25,5.7; 51 2.75,5.7; 52 2.25,5.7; 53 1.75,5.7; 54 1.25,5.7; 55 0.75,5.7; 56 0.25,5.7; 57 -0.25,5.7; 58 -0.75,5.7; 59 -1.25,5.7; 60 -1.75,5.7; 61 -2.25,5.7; 62 -2.75,5.7; 63 -3.25,5.7; 64 -3.75,5.7
SOT23-5 = smd 0.55 x 1.2: 1 -0.95,-1.3; 2 0,-1.3; 3 0.95,-1.3; 4 0.95,1.3; 5 -0.95,1.3
USB_MICRO_THRUHOLE = smd 1.645 x 1.55: PAD$1 -3.123,0; PAD$4 3.123,0 | smd 1.5 x 1.55: PAD$2 -1,0; PAD$3 1,0 | smd 1.25 x 0.95: PAD$5 -2.5,2.7; PAD$6 2.5,2.7 | smd 0.9 x 1.55 bottom: PAD$7 -3.5,0; PAD$8 3.5,0 | smd 1.25 x 0.95 bottom: PAD$9 -2.5,2.7; PAD$10 2.5,2.7 | smd 0.4 x 1.35: PIN$1 -1.3,2.7; PIN$2 -0.65,2.7; PIN$3 0,2.7; PIN$4 0.65,2.7; PIN$5 1.3,2.7
BL-5C-CONNECTOR = smd 1.5 x 1.2: P$1 3.1,-0.2; P$2 0,-0.2; P$3 -3.1,-0.2 | smd 1.5 x 1.5: P$4 1.55,5.9; P$5 -1.55,5.9
SOT23-5L = smd 0.55 x 1.2: 1 -0.95,-1.3; 2 0,-1.3; 3 0.95,-1.3; 4 0.95,1.3; 5 -0.95,1.3
LG132643-DG = hole 2: -35,-18.75; 35,-18.75; 35,18.75; -35,18.75
THERMOCOUPLE_CLIP_INSIDE = smd 4.5 x 8.4: P$1 -4,0; P$2 4,0
NX3225GD = smd 1.5 x 2.7: P$1 0.95,0; P$2 -0.95,0
SO08 = smd 0.61 x 2.21: 1 -1.905,-2.616; 2 -0.635,-2.616; 3 0.635,-2.616; 4 1.905,-2.616; 5 1.905,2.616; 6 0.635,2.616; 7 -0.635,2.616; 8 -1.905,2.616
FPC_12P_1MM = smd 0.5 x 1.5: 1 -5.5,2.297; 2 -4.5,2.297; 3 -3.5,2.297; 4 -2.5,2.297; 5 -1.5,2.297; 6 -0.5,2.297; 7 0.5,2.297; 8 1.5,2.297; 9 2.5,2.297; 10 3.5,2.297; 11 4.5,2.297; 12 5.5,2.297
CRYSTAL-SMD-3.2X1.5MM = smd 1 x 1.8: P$1 -1.25,0; P$2 1.25,0
SPARKFUN-RESISTORS_0603-RES = smd 0.94 x 1.016: 1 -0.85,0; 2 0.85,0

### Placement (x,y rotation side)
BAT1  88.5,16.5 90 bottom
C1  11.75,14.25 90 top
C2  10.75,14.25 90 top
C3  12.5,38.75 270 top
C4  13,20.75 90 top
C5  17.25,2.5 270 top
C6  35.25,2.5 0 top
C7  30,1.5 90 top
C8  33.25,12.75 0 top
C9  35.25,1.5 0 top
C10  46.25,14.75 0 top
C11  19.25,12.25 180 top
C12  19.25,13.25 180 top
C13  29.25,13 90 top
C14  72.5,15.5 180 top
C15  56,13 180 top
C16  16.25,2.25 270 top
C17  31,1.5 90 top
C18  13.5,38.75 90 top
C19  38.25,6 0 top
C20  38.25,5 0 top
C21  30.25,13 90 top
C22  24,41.5 180 top
C23  19,29.5 270 top
C24  17.5,29.5 270 top
C25  88.5,36.5 180 top
C26  11,20.75 270 top
C27  12,20.75 270 top
C28  89,20 180 top
C29  89.5,7.5 180 top
C30  7.5,26 180 top
C31  3.5,36.5 0 top
C32  1.25,7.75 180 top
C33  12.75,9.25 0 top
C34  13.5,32.25 90 top
C35  44.25,14.75 180 top
C36  41.25,13.25 0 top
C37  7.75,5.5 180 top
D2  13.25,12.5 270 top
D3  10,12.5 180 top
D4  7.5,15.5 180 top
IC1  24,31.5 270 top
J1  72.77,6.6 270 top
J2  9.25,38.75 180 bottom
J3  7.25,30.75 0 top
J4  40,42 0 top
J5  56,42 0 top
J6  62,32 0 top
J7  34,32 0 top
J8  44,35 0 top
J9  44,32 0 top
J10  36,32 0 top
J11  36,35 0 top
J12  36,29 0 top
J13  44,29 0 top
J14  46,32 0 top
J15  46,29 0 top
J16  46,35 0 top
J17  34,35 0 top
J18  34,29 0 top
J19  50,32 0 top
J20  60,35 0 top
J21  60,32 0 top
J22  52,32 0 top
J23  52,35 0 top
J24  52,29 0 top
J25  60,29 0 top
J26  62,29 0 top
J27  62,35 0 top
J28  50,35 0 top
J29  50,29 0 top
J30  72,42 0 top
J31  78,32 0 top
J32  66,32 0 top
J33  76,35 0 top
J34  76,32 0 top
J35  68,32 0 top
J36  68,35 0 top
J37  68,29 0 top
J38  76,29 0 top
J39  78,29 0 top
J40  78,35 0 top
J41  66,35 0 top
J42  66,29 0 top
J43  13,47.75 0 bottom
JP1  4.5,10 270 bottom
MODULE1  18,17 0 top
MODULE2  34,17 0 top
MODULE3  50,17 0 top
MODULE4  66,17 0 top
MODULE5  30,20 180 top
MODULE6  46,20 180 top
MODULE7  62,20 180 top
MODULE8  78,20 180 top
R1  5.5,7.75 0 top
R2  11.25,41 90 top
R3  18.5,1.75 270 top
R4  8.75,38.5 90 top
R5  9,45.75 0 top
R6  10.5,43.5 270 top
R7  62,5.25 90 top
R8  58,5.25 270 top
R9  7.25,19.75 0 top
R10  7.25,21 0 top
R11  59,5.25 270 top
R12  60,5.25 270 top
R13  63,5.25 90 top
R14  61,5.25 90 top
R15  3.5,35.25 180 top
R16  7.5,25 180 top
R17  13.5,36.75 90 top
R18  11,38.75 270 top
R19  52,14.75 180 top
R20  7.75,38.5 90 top
R21  7.75,9.75 270 top
R22  7.75,7.75 270 top
R23  8,18.5 0 top
R24  13.5,30.25 270 top
R25  82,9.75 180 top
R26  82,10.75 0 top
S1  92.2,11.02 0 top
S2  92.2,25.5 0 top
S3  92.2,39.98 0 top
S4  3.8,39.98 0 top
S5  3.8,25.5 180 top
S6  3.8,11.02 0 top
S7  2.25,40.75 90 bottom
TP1  22.86,22.86 0 top
TP2  25.4,22.86 0 top
TP3  17.78,22.86 0 top
TP4  20.32,22.86 0 top
TP5  69.75,8 0 bottom
U1  24.25,6.75 180 top
U2  10,9.5 0 top
U4  11.75,17.5 0 top
U$1  1.01,18.39 270 top
U$2  0,-3 0 top
U$3  80.26,11.6 270 bottom
U$4  24,45 0 top
U$5  48,25.5 0 bottom
U$6  [PAX-LOGO-0.5IN]  66.75,0.75 0 bottom
U$7  24,43 180 top
U$8  0.25 in  [PAX-LOGO-0.25IN]  25,29.5 0 bottom
U$9  35.75,5.5 90 top
U$10  11.5,2.5 270 top
U$11  0.25 in  [PAX-LOGO-0.25IN]  46.75,38.25 0 bottom
U$12  0.25 in  [PAX-LOGO-0.25IN]  62.5,38 0 bottom
U$13  78,38 0 bottom
X2  48,11 0 top
Y3  33.25,2.75 270 top
Z1  7.5,17.25 180 top
Z2  7,22.25 180 top

### Tracks (layer width: path | path; a pad name or v marks a point on that pad's centre or on a via)
3.3V  (via drill 0.2, 0.5 pad 1)
  Top 0.25: C7.1 C17.1 | C12.1 C11.1 20.5,12.25 U1.32 | X2.5 46.5,14 46.75,14.25 C10.2 v46.75,15.5 | U1.13 30.75,9 31,9.25 31,9.54 32.5,11 32.5,12.75 C8.1 | C18.2 v13.5,40 | S4.1 1.26,41.49 v1.75,41 | R5.1 v7.75,45.75 | R6.1 v10.5,44.75 | R17.1 v13.5,35.5 | C31.2 v4.75,36.5 | v1,6.75 0.75,7 C32.2 0.75,8.25 1,8.5 1,8.85 S6.3 | R16.1 v8,24 | R23.1 v6.5,18.5 | R4.2 v8.75,39.75 | R22.2 7.5,7 v4.5,7 | U$10.2 9,3.13 9,3 v7.25,3 C37.2 | C5.1 17,2.75 C16.1
  Top 0.254: v17.25,16.75 17.75,16.75 MODULE1.P$1 | v33.25,16.75 33.75,16.75 MODULE2.P$1 | v65.25,16.75 65.75,16.75 MODULE4.P$1 | v49.25,16.75 49.75,16.75 MODULE3.P$1 | U1.32 v20.5,11.5
  Top 0.305: C17.1 28,1 U1.64 v28,2.5 | U1.19 v27,11.5 | C15.2 v55.5,14.75 | v53.75,14.75 53.75,14.25 53.5,14 X2.12 | U1.48 C5.1 | U1.13 28.25,9 v28.25,6.5 | R14.2 R7.2 R13.2 v63,8.5 | C27.2 C26.2 11,18.8 U4.5 | D3.A v9.5,12.5 | S6.3 1.26,10 v1.25,10
  Top 0.406: v29.25,11.5 C13.1 C21.1 | J1.4 72,14.09 C14.2 v70.75,15.5 | v57.25,4.5 57.25,5.75 R8.1 R11.1 R12.1 | v16.75,3.75 16.25,3.25 C16.1 | C34.2 11.06,32.75 J3.8
  Top 0.61: v11.75,19.25 10.8,19.25 U4.5
  Bottom 0.305: v55.5,14.75 v53.75,14.75 | J2.1 6.75,41.16 | 6.75,41.16 6.75,41.25 | 6.75,41.16 6.75,41 v6,41
  pour 3.3V: 96,51 96,0 0,0 0,51 15,51 15,18 81,18 81,51
3.3V_1  (via drill 0.6)
  Top 0.406: 21.38,29 C23.2 C24.2 17.5,22.86 TP3.P$1 17.78,20 MODULE5.P$13 | 21.38,29 IC1.6 | U$4.1 23.05,41.5 C22.2 23.5,40.5 v24,40.5 | 21.38,29 v24,29
  Bottom 0.406: v24,29 v24,40.5
3.3V_2  (via drill 0.6)
  Top 0.5: MODULE6.P$13 v34,24 | v41,39 J4.3
  Bottom 0.5: v34,24 34,26 41,33 v41,39
3.3V_3  (via drill 0.6)
  Top 0.5: J5.3 v57,39 | v50,24 MODULE7.P$13
  Bottom 0.5: v57,39 57,33 50,26 v50,24
3.3V_4  (via drill 0.6)
  Top 0.5: MODULE8.P$13 v66,24 | v73,39 J30.3
  Bottom 0.5: v66,24 66,26 73,33 v73,39
BATT_STAT  (via drill 0.2)
  Top 0.25: U1.40 17.75,7 16.75,8 v15.75,8 | v9,9.25 9.05,9.2 U2.1 9.05,8.25 R22.1
  Bottom 0.25: v15.75,8 15,8.75 9,8.75 v9,9.25
BOOT0  (via drill 0.2)
  Top 0.25: U1.60 v26,3 | R3.2 v17.75,1.25
  Bottom 0.25: v26,3 21,3 19.25,1.25 v17.75,1.25 17.25,1.75 11.25,1.75 4.5,8.5 JP1.2
CAN_RX  (via drill 0.2)
  Top 0.25: U1.61 26.5,8.75 26.25,9 25.75,9 24.5,7.75 v24.5,7.5 | v12.25,3.75 12.25,2.25 10.5,0.5 8.98,0.5 U$10.4
  Bottom 0.25: v24.5,7.5 23.25,7.5 20.75,5 16,5 14.75,3.75 v12.25,3.75
CAN_TX  (via drill 0.2)
  Top 0.25: U1.62 27,9 26.5,9.5 25.5,9.5 v24,8 | v11.75,4.25 9.04,4.25 U$10.1
  Bottom 0.25: v24,8 23,8 20.5,5.5 15.75,5.5 14.5,4.25 v11.75,4.25
CANH  (via drill 0.2, 0.2 pad 0.25)
  Top 0.2: v53,17 53,15.5 53.25,15.25 53.25,14.5 53,14.25 v53,9.5
  Top 0.25: v70,9.5 v70,13 | v21.25,16 v21.25,17 | v31.75,9.5 32.5,9.5 36.5,13.5 36.5,13.75 38.25,15.5 38.75,15.5 39.25,16 v39.25,16.5 | U$10.7 14.63,3.13 15.75,4.25 15.75,4.75 14.75,5.75 14.75,8.75 15.5,9.5 v15.5,14
  Bottom 0.25: MODULE1.P$6 v21.25,17 | v53,17 MODULE3.P$6 | v70,9.5 v53,9.5 v31.75,9.5 19.75,9.5 15.5,13.75 v15.5,14 15.5,16 v21.25,16 | v70,13 MODULE4.P$6 | MODULE2.P$6 38,16.5 v39.25,16.5
CANL  (via drill 0.2)
  Top 0.2: v50.5,15.25 50.5,14.75 51,14.25 v51,10
  Top 0.25: v67,10 v67,13 | v19.25,15.5 v19.25,16.5 | v32.25,10 35,12.75 35,13.75 37.25,16 v37.25,16.5 | U$10.6 14.87,1.86 15.5,2.5 15.5,3.25 16.25,4 16.25,5 15.25,6 15.25,8.5 16,9.25 v16,14.5
  Bottom 0.25: v19.25,16.5 20,16.5 MODULE1.P$4 | MODULE2.P$4 36,16.5 v37.25,16.5 | 52,17.5 MODULE3.P$4 52,16.75 v50.5,15.25 | MODULE4.P$4 68,16.75 v67,15.75 v67,13 | v67,10 v51,10 v32.25,10 20,10 16,14 v16,14.5 16,15.5 v19.25,15.5
D+
  Top 0.406: U$1.PIN$3 5.75,18.39 | 5.75,18.39 5.75,17.25 Z1.2 | R9.1 5.75,19.75 5.75,18.39
D-
  Top 0.406: U$1.PIN$2 5,19.04 5,21 | 5,21 R10.1 | Z2.2 5,22.25 5,21
GND  (via drill 0.2, 0.5 pad 1)
  Top 0.25: C11.2 C12.2 | C29.1 v91,7.5 | C28.1 v90.5,20 | C25.1 v90,36.5 | C30.1 v8,27
  Top 0.406: v5,16.5 5,17.09 U$1.PIN$5 U$1.PAD$10 | U$1.PAD$4 U$1.PAD$3 U$1.PAD$2 1.01,20.75 | 1.01,20.75 U$1.PAD$1 1.01,22.75 0.75,22.75 | U$1.PAD$9 3.71,20.75 1.01,20.75
  Bottom 0.25: S7.1 2.3,38.95 v2.25,39
  Bottom 0.254: v16.75,17.25 17.75,17.25 MODULE1.P$2 | v32,17.25 33.75,17.25 MODULE2.P$2 | v48.75,17.25 49.75,17.25 MODULE3.P$2 | v64.75,17.25 65.75,17.25 MODULE4.P$2
  Bottom 0.406: U$1.PAD$7 1.01,22.75 0.75,22.75 | U$1.PAD$8 0.75,14.89 v0.75,14 | U$1.PAD$9 3.75,20.89 v3.75,22 | U$1.PAD$10 3.71,16.5 v5,16.5
  other vias: 9.5,16.5 56.5,14.75 28,11.5 29,6.5 30,11.5 28.25,3.5 41.5,4.5 40,4.5 26.75,17.25 40.75,17.25 53.5,15.75 52.5,15.5 47.75,17 55,15.75 57.25,13.25 60.5,15.5 60.75,13.5 60.5,12 62,8.5 64.5,8.5 62.5,13.25 62.5,15.25 63.75,12 67.75,8.5 69.5,10.25 70.25,8.75 71.25,8.75 72.5,9.75 72.5,12 69.5,12 67.5,12 74.25,12 74,7.25 75.25,8.25 78,10 78,7 75,16.75 77,16.5 79,16.75 72,4.5 20,9 42.5,14.5 35,8 71.75,3 34,14.5 15.75,6.25 8.5,14 54.25,2.75 62.5,2.75 78,3.5 94.25,7.25 84.25,29.5 92,31 84,35.5 84.5,40.5 89.25,43.75 7.25,13.75 4.75,0.75 3,7.25 4.75,30.75 92,35.5 14.25,9.5 7.5,15.5 11,5.75 10.25,9.75 13.25,10 12.5,11.75 10,22 3.75,24 12.75,25 5,27 12.5,31.25 12.75,36 4.5,38 1.75,37 6.5,44 8.25,48.75 11.75,50 14,46 13.75,42 9,20.25 1,11.25 82.75,22.25 89.5,29.25 94,18 86,6.5 85,3.25 19.75,11.25 22,10.75 12.75,30 9.5,7.25 5.75,35 12.5,37.5 16.75,4.5 20,4.25 73,16.75 39.5,13 45.25,11.5 44.25,11.5 13,15 69.5,15.5 7.25,2 20.75,15.5 22.75,15.5 32,6.5
  pour GND: 96,51 96,0 0,0 0,51 15,51 15,18 81,18 81,51
  pour Bottom: 0,51 15,51 15,18 81,18 81,51 96,51 96,0 0,0
  pour Top: 96,51 81,51 81,18 15,18 15,51 0,51 0,0 96,0
GND_1  (via drill 0.6)
  other vias: 30,33 30,27 30,22.5 24,25.54 19,27 17.5,34.5 23.5,50 16.75,21.25
  pour Top: 16,51 16,19 31.5,19 31.5,51
  pour Bottom: 16,51 16,19 31.5,19 31.5,51
GND_2  (via drill 0.6)
  other vias: 36,22 37,25 43,39 35,40 37,46 43,46 40,30 46,27 38,33 42,33 37,38
  pour Bottom: 32.5,51 32.5,19 47.5,19 47.5,51
  pour Top: 32.5,51 32.5,19 47.5,19 47.5,51
GND_3  (via drill 0.6)
  other vias: 51,40 53,38 59,39 54,33 58,33 56,30 62,27 53,25 52,22 53,46 59,46
  pour Bottom: 48.5,51 48.5,19 63.5,19 63.5,51
  pour Top: 48.5,51 48.5,19 63.5,19 63.5,51
GND_4  (via drill 0.6)
  other vias: 67,40 69,38 75,39 70,33 74,33 72,30 78,27 69,25 68,22 69,46 75,46
  pour Top: 64.5,51 64.5,19 80,19 80,51
  pour Bottom: 64.5,51 64.5,19 80,19 80,51
I2C1_SCL  (via drill 0.2)
  Top 0.25: U1.58 25,3.5 25.5,4 v25.5,8 | v33.25,8 38,12.75 38,13.75 38.25,14 39.5,14 v41,15.5 | v25.25,15.5 v25.25,16.5
  Bottom 0.25: v25.25,15.5 v41,15.5 42,16.5 MODULE2.P$10 | v25.5,8 v33.25,8 | v25.25,16.5 26,16.5 MODULE1.P$10
I2C1_SDA  (via drill 0.2)
  Top 0.25: v39.75,16 39.75,15.75 39,15 38.5,15 37.5,14 37.5,13 33,8.5 v32,8.5 | v23.25,16 v23.25,17 | v26,8.5 26,3.75 25.5,3.25 U1.59
  Bottom 0.25: v23.25,16 v39.75,16 39.75,17 MODULE2.P$8 | v26,8.5 v32,8.5 | v23.25,17 MODULE1.P$8
I2C2_SCL  (via drill 0.2)
  Top 0.25: U1.29 v22,11.5 | v58.75,12.5 v58.75,16.5
  Bottom 0.25: v22,11.5 22,12.5 v58.75,12.5 73.25,12.5 73.25,14.75 74,15.5 MODULE4.P$10 | v58.75,16.5 58,16.5 MODULE3.P$10
I2C2_SDA  (via drill 0.2)
  Top 0.25: U1.30 21.5,6.25 v22.25,5.5 | v57.75,16 v57.75,7 | v72,7 v72,13
  Bottom 0.25: MODULE3.P$8 56,16 v57.75,16 | v22.25,5.5 22.25,5.75 23.5,7 v57.75,7 v72,7 | v72,13 MODULE4.P$8
LCD_A0  (via drill 0.2)
  Top 0.25: X2.8 v49.5,6.5 | U1.8 30.75,6.5 31.25,6 33,6 v33.5,6.5
  Bottom 0.25: v49.5,6.5 v33.5,6.5
LCD_BL  (via drill 0.2)
  Top 0.2: v49,14.75 v49,2
  Top 0.25: U1.56 v24,2 | R19.2 v51.5,15.5
  Bottom 0.25: v24,2 v49,2 | v51.5,15.5 R19.2 v49,14.75
LCD_CS  (via drill 0.2)
  Top 0.25: U1.50 21,2.25 21,2.75 21.75,3.5 21.75,4.5 20.5,5.75 20.5,8.75 21,9.25 v21,10.5 | X2.10 v51.5,12 | v54.5,13 v54.5,12
  Bottom 0.25: v21,10.5 21,13 38.75,13 39.25,13.5 40,13.5 40.5,13 v54.5,13 | v54.5,12 v51.5,12
LCD_MOSI  (via drill 0.2)
  Top 0.25: X2.6 v47.5,12 | U1.57 24.5,6.25 23.5,7.25 23.5,9 24.5,10 v24.5,11.25
  Bottom 0.25: v24.5,11.25 24.5,12 v47.5,12
LCD_RST  (via drill 0.2)
  Top 0.25: X2.9 v50.5,3 | U1.2 v31,3.5
  Bottom 0.25: v31,3.5 31.5,3 v50.5,3
LCD_SCK_SWO  (via drill 0.2)
  Top 0.25: X2.7 v48.5,2.5 | U1.55 v23.5,2.5
  Top 0.254: v23.5,2.5 23.5,4.25 23.25,4.5 22.5,4.5 21,6 v21,8.25 | v9.25,34 v13.25,34
  Bottom 0.25: v23.5,2.5 26.75,2.5 27.25,3 28.25,3 28.75,2.5 v48.5,2.5 | v21,8.25 20,7.25 20,6.25 18.25,6.25 18.25,8.75 14,13 14,31.75 13.25,32.5 v13.25,34
  Bottom 0.254: J2.6 v9.25,34
MOD1_GPIO1
  Top 0.25: U1.24 24.5,13.5 25.25,13.5 25.25,14.25 MODULE1.P$11
MOD2_GPIO0  (via drill 0.2)
  Top 0.25: U1.15 30.75,10 32,11.25 32,13.25 33.75,15 34.75,15 v34.75,14.5 | v38.75,14.5 39.25,14.5 41.75,17 MODULE2.P$9
  Bottom 0.25: v38.75,14.5 v34.75,14.5
MOD2_GPIO1  (via drill 0.2)
  Top 0.25: U1.11 30.75,8 31.75,9 32.75,9 37,13.25 v37,13.5 | MODULE2.P$11 43.5,17 42.5,16 42.25,16 39.75,13.5 v38.5,13.5
  Bottom 0.25: v38.5,13.5 v37,13.5
MOD3_GPIO1  (via drill 0.2)
  Top 0.25: v60,8.5 MODULE3.P$11 | v34.5,8.5 33.5,7.5 U1.10
  Bottom 0.25: v34.5,8.5 v60,8.5
MOD4_GPIO0  (via drill 0.2)
  Top 0.25: U1.25 24,10.25 23,9.25 23,7 23.25,6.75 v24,6 | v76.5,6 76.5,15.25 74,15.25 MODULE4.P$9
  Bottom 0.25: v24,6 v76.5,6
MOD4_GPIO1  (via drill 0.2)
  Top 0.25: U1.27 23,10.75 22,9.75 22,6.5 23.25,5.25 v23.25,5 | v77.25,5.5 77.25,15.75 76,15.75 MODULE4.P$11
  Bottom 0.25: v23.25,5 23.75,5.5 v77.25,5.5
N$1
  Top 0.406: 12.95,20.25 12.95,20.2 C4.1
  Top 0.5: U4.4 13,19.25 C4.1 12.95,20.25
N$4
  Top 0.305: R19.1 X2.11
N$5
  Top 0.5: J15.P$1 J14.P$1 J16.P$1 46,37 39,37 J4.2
N$10
  3.3V 1: 0.7,14.9 1.3,14.9
N$12
  3.3V 1: 3.7,15.7 3.7,16.1
N$13
  Top 0.5: J26.P$1 J6.P$1 J27.P$1 62,37 55,37 J5.2
N$14
  3.3V 1: 0.7,21.9 1.3,21.9
N$25
  Top 0.406: IC1.2 25,34.04 25,39 28,39 U$7.P$1
N$26
  Top 0.406: IC1.1 21.5,35.31 21.5,40.5 20,40.5 U$7.P$2
N$37
  Top 0.305: X2.3 44.5,14.25 44.75,14.5 C35.1
N$38
  Top 0.305: X2.2 43.5,14.25 43.75,14.5 C35.2
N$39
  Top 0.305: C36.2 42.5,13.25 X2.1
N$42
  Top 0.5: J18.P$1 J7.P$1 J17.P$1 34,37 37,40 J4.1
N$43
  Top 0.5: J29.P$1 J19.P$1 J28.P$1 50,37 53,40 J5.1
N$45  (via drill 0.6)
  Top 0.5: J20.P$1 58,35 57,34 v57,24
  Bottom 0.5: v57,24 58,23 MODULE7.P$6
N$47  (via drill 0.6)
  Top 0.5: J21.P$1 59,32 58,31 58,27 60,25 v60,24
  Bottom 0.5: v60,24 MODULE7.P$4
N$51  (via drill 0.6)
  Top 0.5: J8.P$1 42,35 41,34 v41,24
  Bottom 0.5: v41,24 42,23 MODULE6.P$6
N$52  (via drill 0.6)
  Top 0.5: J9.P$1 43,32 42,31 42,27 44,25 v44,24
  Bottom 0.5: v44,24 MODULE6.P$4
N$53  (via drill 0.6)
  Top 0.5: J10.P$1 37,32 38,31 v38,27
  Bottom 0.5: v38,27 43,27 46,24 MODULE6.P$2
N$54  (via drill 0.6)
  Top 0.5: J11.P$1 38,35 39,34 v39,24
  Bottom 0.5: v39,24 40,23 MODULE6.P$8
N$55
  Top 0.5: J13.P$1 44,27 46,25 46,24 44,22 MODULE6.P$3
N$56
  Top 0.5: J12.P$1 36,24 38,22 42,22 MODULE6.P$5
N$57  (via drill 0.6)
  Top 0.5: J22.P$1 53,32 54,31 v54,27
  Bottom 0.5: v54,27 59,27 62,24 MODULE7.P$2
N$58  (via drill 0.6)
  Top 0.5: J23.P$1 54,35 55,34 v55,24
  Bottom 0.5: v55,24 56,23 MODULE7.P$8
N$59
  Top 0.5: MODULE7.P$3 60,22 62,24 62,25 60,27 J25.P$1
N$60
  Top 0.5: MODULE7.P$5 58,22 54,22 52,24 J24.P$1
N$61
  Top 0.5: J39.P$1 J31.P$1 J40.P$1 78,37 71,37 J30.2
N$62
  Top 0.5: J42.P$1 J32.P$1 J41.P$1 66,37 69,40 J30.1
N$63  (via drill 0.6)
  Top 0.5: J33.P$1 74,35 73,34 v73,24
  Bottom 0.5: v73,24 74,23 MODULE8.P$6
N$64  (via drill 0.6)
  Top 0.5: J34.P$1 75,32 74,31 74,27 76,25 v76,24
  Bottom 0.5: v76,24 MODULE8.P$4
N$65  (via drill 0.6)
  Top 0.5: J35.P$1 69,32 70,31 v70,27
  Bottom 0.5: v70,27 75,27 78,24 MODULE8.P$2
N$66  (via drill 0.6)
  Top 0.5: J36.P$1 70,35 71,34 v71,24
  Bottom 0.5: v71,24 72,23 MODULE8.P$8
N$67
  Top 0.5: J38.P$1 76,27 78,25 78,24 76,22 MODULE8.P$3
N$68
  Top 0.5: MODULE8.P$5 74,22 70,22 68,24 J37.P$1
N$70
  Top 0.25: R21.1 8.5,10.25 8.5,10.75 9.05,10.75 U2.5
NRST  (via drill 0.2)
  Top 0.25: U1.7 27.5,6 v27.5,3.5 | v11.75,37.5 11.75,38.75 12.25,39.25 C3.1 v12.5,41.25 | R17.2 13,37.25 12.75,37 12.25,37 v11.75,37.5 | v3,25.5 v2,25.5 | v5,35.75 10,35.75 v11.75,37.5
  Bottom 0.25: v27.5,3.5 20.75,3.5 19.5,2.25 11.5,2.25 6,7.75 6,17 5.5,17.5 5.5,19.5 6,20 6,22.5 v3,25.5 | J2.10 11.75,37.59 v11.75,37.5 11.75,36.38 J2.10 | 11.88,36.25 J2.10 | S7.4 1.8,42.55 2.75,43.5 5.5,43.5 6.5,42.5 12,42.5 12.5,42 v12.5,41.25 | v2,25.5 2,32.75 v5,35.75
OSC_IN
  Top 0.25: U1.5 36.05,5 U$9.P$2 36.45,5 36.75,4.5 36.75,5 C20.1
OSC_OUT
  Top 0.25: U1.6 33.25,5.5 34,6.25 35.8,6.25 U$9.P$1 36.45,6.5 37,6 C19.1
PC1  (via drill 0.2)
  Top 0.25: U1.9 33.75,7 34.25,7.5 36,7.5 v36.5,8
  Bottom 0.25: v36.5,8 TP5.P$1
PULLBACK_1
  3.3V 1: 3.7,20.7 3.7,21.1
RTC_BAT  (via drill 0.2)
  Top 0.25: U1.1 31.5,3 32,2.5 32,0.5 87.25,0.5 v87.25,2.25
  Bottom 0.25: v87.25,2.25 87.25,8.5 BAT1.PWR@1
RTC_OSC_IN
  Top 0.25: U1.3 31.25,4 33,2.25 33,1.75 Y3.P$2 33.5,1.25 33.75,1.5 C9.1
RTC_OSC_OUT
  Top 0.25: U1.4 31.75,4.5 32.25,4 Y3.P$1 C6.1
SCL_1  (via drill 0.6)
  Top 0.406: IC1.8 26.62,27.62 26.5,27.5 26.5,24 26.25,23.75 TP2.P$1 | v25,48.75 24.95,48.7 U$4.4
  Bottom 0.406: MODULE5.P$6 26,22.17 TP2.P$1 25,23.55 v25,48.75
SDA_1  (via drill 0.6)
  Top 0.406: IC1.7 22.86,26.21 TP1.P$1 | v23.25,47.75 23.25,47.5 23.05,47.3 U$4.5
  Bottom 0.406: MODULE5.P$8 24,21.72 TP1.P$1 23,23 23,46.5 23,47.5 v23.25,47.75
SDIO_CLK  (via drill 0.2)
  Top 0.25: 22.5,1 U1.53 22.5,3.75 v22.25,4 | v62.5,4 62,4.5 R7.1
  Top 0.254: v70.75,4.5 70.75,14.09 J1.5
  Bottom 0.25: v22.25,4 22.75,4.5 31.75,4.5 32.25,4 v62.5,4 66.5,4 67,4.5 v70.75,4.5
SDIO_CMD  (via drill 0.2)
  Top 0.25: U1.54 v23,4 | v61.5,3.5 61,4 R14.1
  Top 0.254: v73,3.75 73,14.09 J1.3
  Bottom 0.25: v23,4 31.5,4 32,3.5 v61.5,3.5 66.75,3.5 67.25,4 68.5,4 68.75,3.75 v73,3.75
SDIO_D0  (via drill 0.2)
  Top 0.25: U1.39 v19.5,7.5 | v63.75,7.5 63.75,4.75 R13.1
  Top 0.254: v68.5,7.5 68.5,14.09 J1.7
  Bottom 0.25: v19.5,7.5 21,9 23.5,9 24,8.5 24.75,8.5 25,8.25 25,7.5 v63.75,7.5 v68.5,7.5
SPI1_MISO  (via drill 0.2)
  Top 0.2: v54,9 54,13.75 54.25,14 54.25,15.75 54,16 MODULE3.P$5
  Top 0.25: v69,9 v69,13 | v69,17 MODULE4.P$5 | U1.22 25.5,10.25 v24.25,9
  Bottom 0.25: v24.25,9 v54,9 v69,9 | v69,13 v69,17
SPI1_MOSI  (via drill 0.2)
  Top 0.2: 50,15.5 v50,10.5
  Top 0.25: v68,15.5 MODULE4.P$3 | U1.23 v25,10.75 | MODULE3.P$3 52,16.25 50.75,16.25 50,15.5 | v68,10.5 v68,13
  Bottom 0.25: v25,10.75 25,10.5 v50,10.5 v68,10.5 | v68,13 v68,15.5
SPI1_NSS  (via drill 0.2)
  Top 0.25: U1.20 v26.5,14 | v57.25,14 57.25,17 MODULE3.P$9
  Bottom 0.25: v26.5,14 v57.25,14
SPI1_SCK  (via drill 0.2)
  Top 0.25: v71.25,17 MODULE4.P$7 | U1.21 v26,11 | v58.25,11 v58.25,15.55 | v56,15.55 MODULE3.P$7 | v71.25,11 v71.25,13
  Bottom 0.25: v26,11 v58.25,11 v71.25,11 | v71.25,13 v71.25,17 | v56,15.55 v58.25,15.55
SPI2_MISO  (via drill 0.2, 0.2 pad 0.25)
  Top 0.25: v32.25,15 32.75,15.5 36,15.5 36.75,16.25 36.75,17 MODULE2.P$5 | U1.35 17.25,9.5 17,9.75 v17,14.5 | v22,14.5 MODULE1.P$5
  Bottom 0.25: v32.25,15 31.75,14.5 v22,14.5 v17,14.5
SPI2_MOSI  (via drill 0.2, 0.2 pad 0.25)
  Top 0.25: MODULE1.P$3 v20,15 | MODULE2.P$3 36,16.25 35.75,16 32.5,16 v31.5,15 | U1.36 17,9 16.5,9.5 v16.5,15
  Bottom 0.25: v31.5,15 v20,15 v16.5,15
SPI2_NSS  (via drill 0.2)
  Top 0.25: U1.33 18,10.5 v18,14 | MODULE1.P$9 24.75,17 v24.75,14
  Bottom 0.25: v18,14 v24.75,14
SPI2_SCK  (via drill 0.2, 0.2 pad 0.25)
  Top 0.25: v35.5,13.5 38,16 38.5,16 38.75,16.25 38.75,17 MODULE2.P$7 40,16.75 | U1.34 17.5,10 v17.5,13.25 | MODULE1.P$7 v24,13.5
  Bottom 0.25: v35.5,13.5 v24,13.5 17.75,13.5 v17.5,13.25
SW_A  (via drill 0.2)
  Top 0.25: U1.52 v22,2 | R8.2 v58,2.25 | v88,1.75 88,2.25 87.5,2.75 87.5,36 C25.2 88,38.07 S3.3
  Bottom 0.25: v22,2 22,1.5 57.25,1.5 v58,2.25 60.5,2.25 61,1.75 v88,1.75
SW_B  (via drill 0.2)
  Top 0.25: U1.51 v21.5,2.5 | R11.2 v59,1.75 | S2.3 88.5,23.59 C28.2 88.5,19.5 88,19 88,3 88.5,2.5 v88.5,1.25
  Bottom 0.25: v21.5,2.5 21.5,1 58.25,1 v59,1.75 60.25,1.75 60.75,1.25 v88.5,1.25
SW_C  (via drill 0.2)
  Top 0.25: U1.38 20,8 20,5.5 21.25,4.25 21.25,3.75 20,2.5 v20,1.25 | R12.2 v60,1.25 | v89,0.75 C29.2 89,9.12 S1.3
  Bottom 0.25: v20,1.25 20,0.5 59.25,0.5 v60,1.25 60.5,0.75 v89,0.75
SW_D_BOOT0  (via drill 0.2)
  Top 0.25: S4.3 1.26,38 1.25,38 | 1.5,38 3,38 v3,37.5 C31.1 R15.2 | U1.41 17.5,6.5 16.75,7.25 v15.75,7.25 | v2.5,25 v1.5,25 | v8,11.5 v4.5,11.5
  Top 0.406: 1.26,38 1.5,38
  Bottom 0.25: v15.75,7.25 14.75,8.25 8,8.25 v8,11.5 | JP1.1 v4.5,11.5 4.5,12.25 2.75,14 2.75,24.25 2.5,24.5 v2.5,25 | v1.5,25 1.5,33.25 3,34.75 v3,37.5
SW_E_BOOT1  (via drill 0.2)
  Top 0.25: U1.28 22.5,13.25 22.25,13.5 20.75,13.5 20,14.25 19.75,14.25 18.75,15.25 18.75,15.5 18.25,16 15.75,16 14,17.75 14,22.5 9.25,22.5 8.75,23 v8.75,27.75 | v5,27.75 6,27.75 S5.3 6.34,26.66 C30.2 R16.2
  Bottom 0.25: v8.75,27.75 v5,27.75
SW_PWR  (via drill 0.2)
  Top 0.2: R1.2 5.5,8.5 3.75,8.5
  Top 0.25: U1.14 27.5,9.5 v27.5,6.5 | 1.26,11.99 S6.1 | 1.26,11.99 1.25,12.5 | 2.25,7.75 C32.1 3,7.75 | 1.26,11.99 3,10.25 3,7.75 | 3.75,8.5 3,7.75 | v6.75,7.75 R1.2
  Bottom 0.25: v27.5,6.5 23.75,6.5 23.5,6.25 23.5,6 21.5,4 20.5,4 19.25,2.75 11.75,2.75 v6.75,7.75
SWCLK  (via drill 0.2)
  Top 0.25: U1.49 20.5,0.5 17.75,0.5 v17,1.25 | v10,38.75 10,39.25 R18.1 11.25,39.5 R2.1 | v2,24.5 v0.75,24.5 | v1,34.5 v10,34.5
  Bottom 0.2: v10,34.5 v10,38.75
  Bottom 0.25: v17,1.25 11,1.25 3.5,8.75 3.5,12.5 2.25,13.75 2.25,23.75 2,24 v2,24.5 | v0.75,24.5 0.5,24.75 0.5,34 v1,34.5
SWDCLK_M  (via drill 0.2)
  Top 0.25: v11.25,35.25 v8,35.25 | v11,37.5 R18.2
  Bottom 0.25: v8,35.25 8,36.34 J2.4 | v11.25,35.25 11.25,37.25 v11,37.5
SWDIO  (via drill 0.2)
  Top 0.25: U1.46 17.75,4 v17.5,3.75 | v3.5,26 v1,26 | R4.1 R20.1 v7.25,37.25 | v7.25,34 v1.5,34
  Bottom 0.25: v17.5,3.75 17,3.25 12,3.25 6.5,8.75 6.5,17.25 6,17.75 6,19.25 6.5,19.75 6.5,22.75 3.5,25.75 v3.5,26 | v1.5,34 1,33.5 v1,26 | v7.25,37.25 v7.25,34
SWDIO_M  (via drill 0.2)
  Top 0.25: R20.2 v7.75,39.75
  Bottom 0.25: v7.75,39.75 6,39.75 6,36.25 6.71,36.25 J2.2
USART1_RX  (via drill 0.2)
  Top 0.2: 9.75,40.75 9.75,44.75
  Top 0.25: U1.43 19.5,5.5 v19.5,6.75 | J3.2 3.5,32.08 5,33.5 v13.75,33.5 | 10.25,45.75 10.25,47.5 10.46,47.71 J43.2 | R5.2 10.25,45.75 | 9.75,44.75 10.25,45.25 10.25,45.75 | 9.75,40.75 v10.5,40
  Bottom 0.25: v19.5,6.75 19,6.75 19,8.75 14.5,13.25 14.5,32.75 v13.75,33.5 14.5,34.25 14.5,39.75 13.5,40.75 13,40.75 12.25,40 v10.5,40 | v10.5,40 10.52,40.02 10.5,40.04 10.46,40.04 | 10.5,41.14 v10.5,40
  Bottom 0.254: 10.5,41.14 J2.7
USART1_TX  (via drill 0.2)
  Top 0.25: v10.75,34.75 v12.75,34.75 14.5,34.75 14.5,42.75 11.25,42.75 11.25,43 | 11.25,43 11.25,45.25 13,47 J43.1 | R6.2 11.25,43 | v13.5,28.75 12.75,28.75 12,29.5 11.08,29.5 J3.7 | v17.5,6 U1.42
  Bottom 0.25: v12.75,34.75 12.75,32.25 13.5,31.5 v13.5,28.75 13.5,12.75 17.75,8.5 17.75,6.25 v17.5,6 | v10.75,34.75 10.5,35
  Bottom 0.254: 10.5,35 10.5,36.36 J2.8
USART2_RX  (via drill 0.2)
  Top 0.2: v44,16 43.75,16 43,15.25 v43,11.5
  Top 0.25: v28.75,16.5 28.75,16 28,15.25 28,14.5 | U1.17 28,14.5 | v76,6.5 v76,12.5 | v59.25,17 v59.25,6.5 | v43,4.5 v43,11.5 | 28,14.5 30.5,14.5 31,14 31,11.75 v30.75,11.5 | v51,6.5 v51,4.5
  Bottom 0.25: v28.75,16.5 28,16.5 MODULE1.P$12 | v76,6.5 v59.25,6.5 v51,6.5 | v76,12.5 MODULE4.P$12 | MODULE3.P$12 v59.25,17 | v44,16 MODULE2.P$12 | v30.75,11.5 v43,11.5 | v43,4.5 v51,4.5
USART2_TX  (via drill 0.2)
  Top 0.2: v48,16.25 v48,11.5
  Top 0.25: v61.25,16.5 v61.25,11.5 | U1.16 30.5,10.5 31.5,11.5 31.5,13.5 | 31.5,13.5 31.5,14.25 30.75,15 v30.75,16.75 | v78,11.5 v78,15.75 | v33,15 31.5,13.5
  Bottom 0.25: v48,11.5 v61.25,11.5 v78,11.5 | MODULE1.P$14 30,16.75 v30.75,16.75 | MODULE3.P$14 62,16.5 v61.25,16.5 | MODULE2.P$14 46,16.5 46.25,16.25 | v33,15 45,15 46.25,16.25 | 46.25,16.25 v48,16.25 | v78,15.75 MODULE4.P$14
USB_DM  (via drill 0.2)
  Top 0.25: R10.2 10,21 10,17.75 13.25,17.75 15,16 v15,10.5 | U1.44 17.75,5 16.75,6 v16.75,6.25
  Bottom 0.25: v16.75,6.25 16.75,8.75 v15,10.5
USB_DP  (via drill 0.2)
  Top 0.25: R9.2 9.5,19.75 9.5,18.5 | 9.5,18.5 9.5,17.25 13,17.25 14.5,15.75 v14.5,11 | R23.2 9.5,18.5 | U1.45 17.5,4.5 16.25,5.75 v16.25,6.75
  Bottom 0.25: v16.25,6.75 16.25,8.5 14.5,10.25 v14.5,11
VBAT  (via drill 0.2, 0.6)
  Top 0.25: R25.1 v82.5,8.5
  Top 0.4: 11,8.2 11,9.25 C33.1 12.25,10.75 13.25,10.75 D2.A | v6.25,1.5 6.25,6.5 11,6.5 11,8.2 | 11,8.2 U2.3
  3.3V 0.4: v82.5,3.5 79.5,0.5 7.25,0.5 v6.25,1.5
  Bottom 0.25: v82.5,8.5 U$3.P$1
  Bottom 0.406: v82.5,8.5 82.5,8.25 81.5,7.25 81.5,4.75 v82.5,3.5
VBAT_DIV2  (via drill 0.2)
  Top 0.25: 81.5,10.25 R25.2 | U1.26 23.5,10.5 22.5,9.5 22.5,6.75 24,5.25 v24,5 | v79,5 79,10.25 81.5,10.25 | 81.5,10.25 R26.1
  Bottom 0.25: v24,5 v79,5
VBUS
  Top 0.406: U4.1 10.75,16.2 C2.2 C1.2 12.25,14.75 13,14 13.25,14 | 13.25,14 13.75,14.5 | 13.75,14.5 13.75,15.5 13.05,16.2 U4.3 | 13.75,14.5 D2.C 13.25,14 | 13.25,14 13.25,12.5 D3.C 11.57,10.8 U2.4
  Top 0.61: D4.C 9.75,14.75 C2.2
VBUS_IN
  Top 0.406: U$1.PIN$1 2.4,19.69 2.4,19.5
  Top 0.61: 2.4,19.5 2.4,14.7 4.6,14.7 5.4,15.5 D4.A
WIFI_EN  (via drill 0.2)
  Top 0.2: J3.4 5.98,30.77 6,30.75 R24.1
  Top 0.25: U1.37 v19.5,8.5 | R24.1 14.5,30.75 14.5,18 v15,17.5
  Bottom 0.25: v15,17.5 15,13.5 19.5,9 v19.5,8.5

### Text on the board
tPlace: SW_D | SW_A | SDA | SCL | SDA | SCL | SDA | SCL | TX | RX | TX | RX | TX | RX | D0 | D1 | D0 | D1 | D0 | D1 | SW_B | SW_E | MCP3424 | 3.3V | GND | SDA | SCL | M2 / GPIO0 | M2 / GPIO1 | SPI1 | MOSI | SCK | M4 / GPIO0 | M4 / GPIO1 | 3V3 | SPI1 | MOSI | MISO | 3V3 | SPI2 / MOSI | SPI2 / MISO | SPI2 / SCK | SPI2 / NSS | MOD1 / GPIO1 | 3V3 | SPI2 / MOSI | SPI2 / MISO | SPI2 / SCK | MISO | SPI2 / SCK | SPI1 / NSS | MOD3 / GPIO1 | 3V3 | SW_C | SW_PWR
bPlace: RX | TX | MCP9800 | USART1 | RESET | CORTEX | Pax Instruments / Grove module | Pax Instruments / Grove module | Pax Instruments / Grove module | USART1 / RX | WIFI_EN | 3V3 | ESP8266 | USART1 / TX | GND | 3.3V | GND | SDA | SCL | USART2 / RX | USART2 / TX | USART2 / RX | USART2 / TX | GND | CANL | CANH | I2C1 / SDA | I2C1 / SCL | USART2 / RX | USART2 / TX | GND | CANL | CANH | I2C1 / SDA | I2C1 / SCL | USART2 / RX | USART2 / TX | GND | CANL | CANH | I2C2 / SDA | I2C2 / SCL | GND | CANL | CANH | I2C2 / SDA | I2C2 / SCL | Pax Instruments | BOOT0 | PC1 | LabWiz 0.1 / rev2